# EAGLE design untitled (EAGLE 6.5.0)
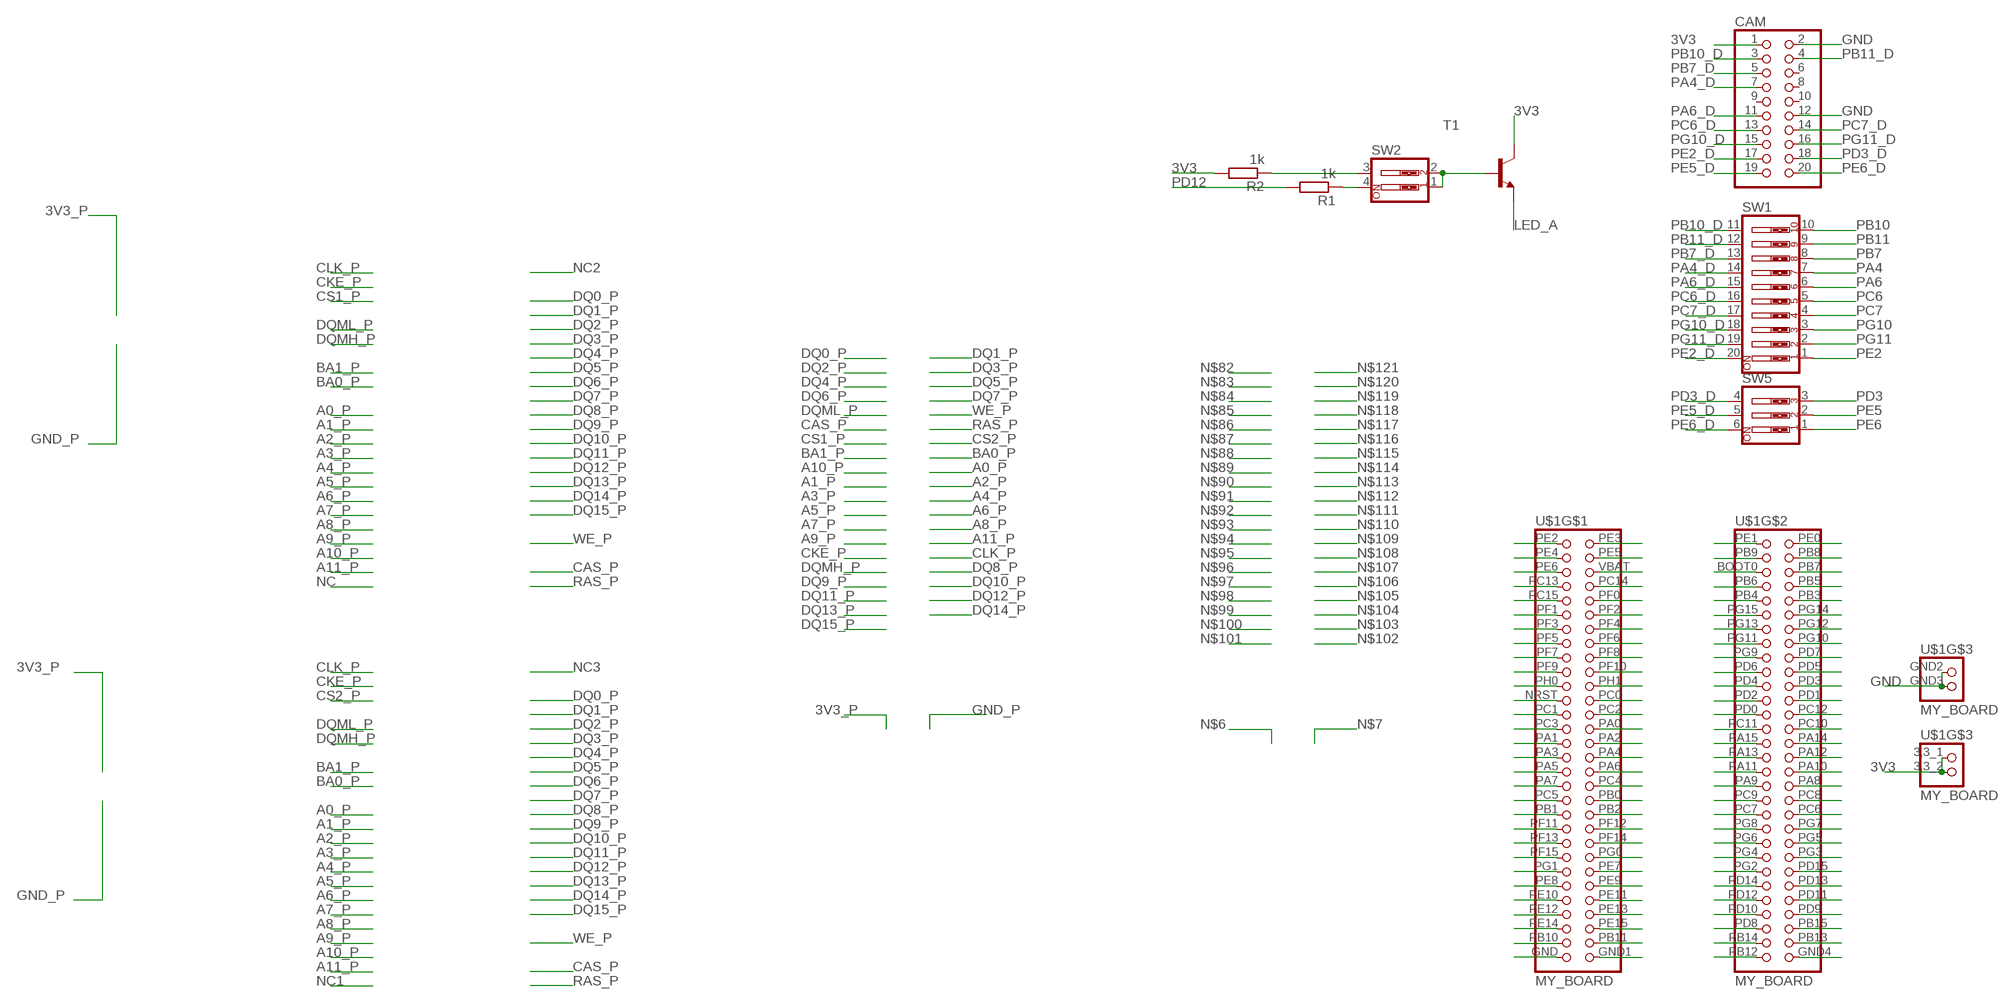
[diagram p0: schematic, sheet 1, part 1 of 2]
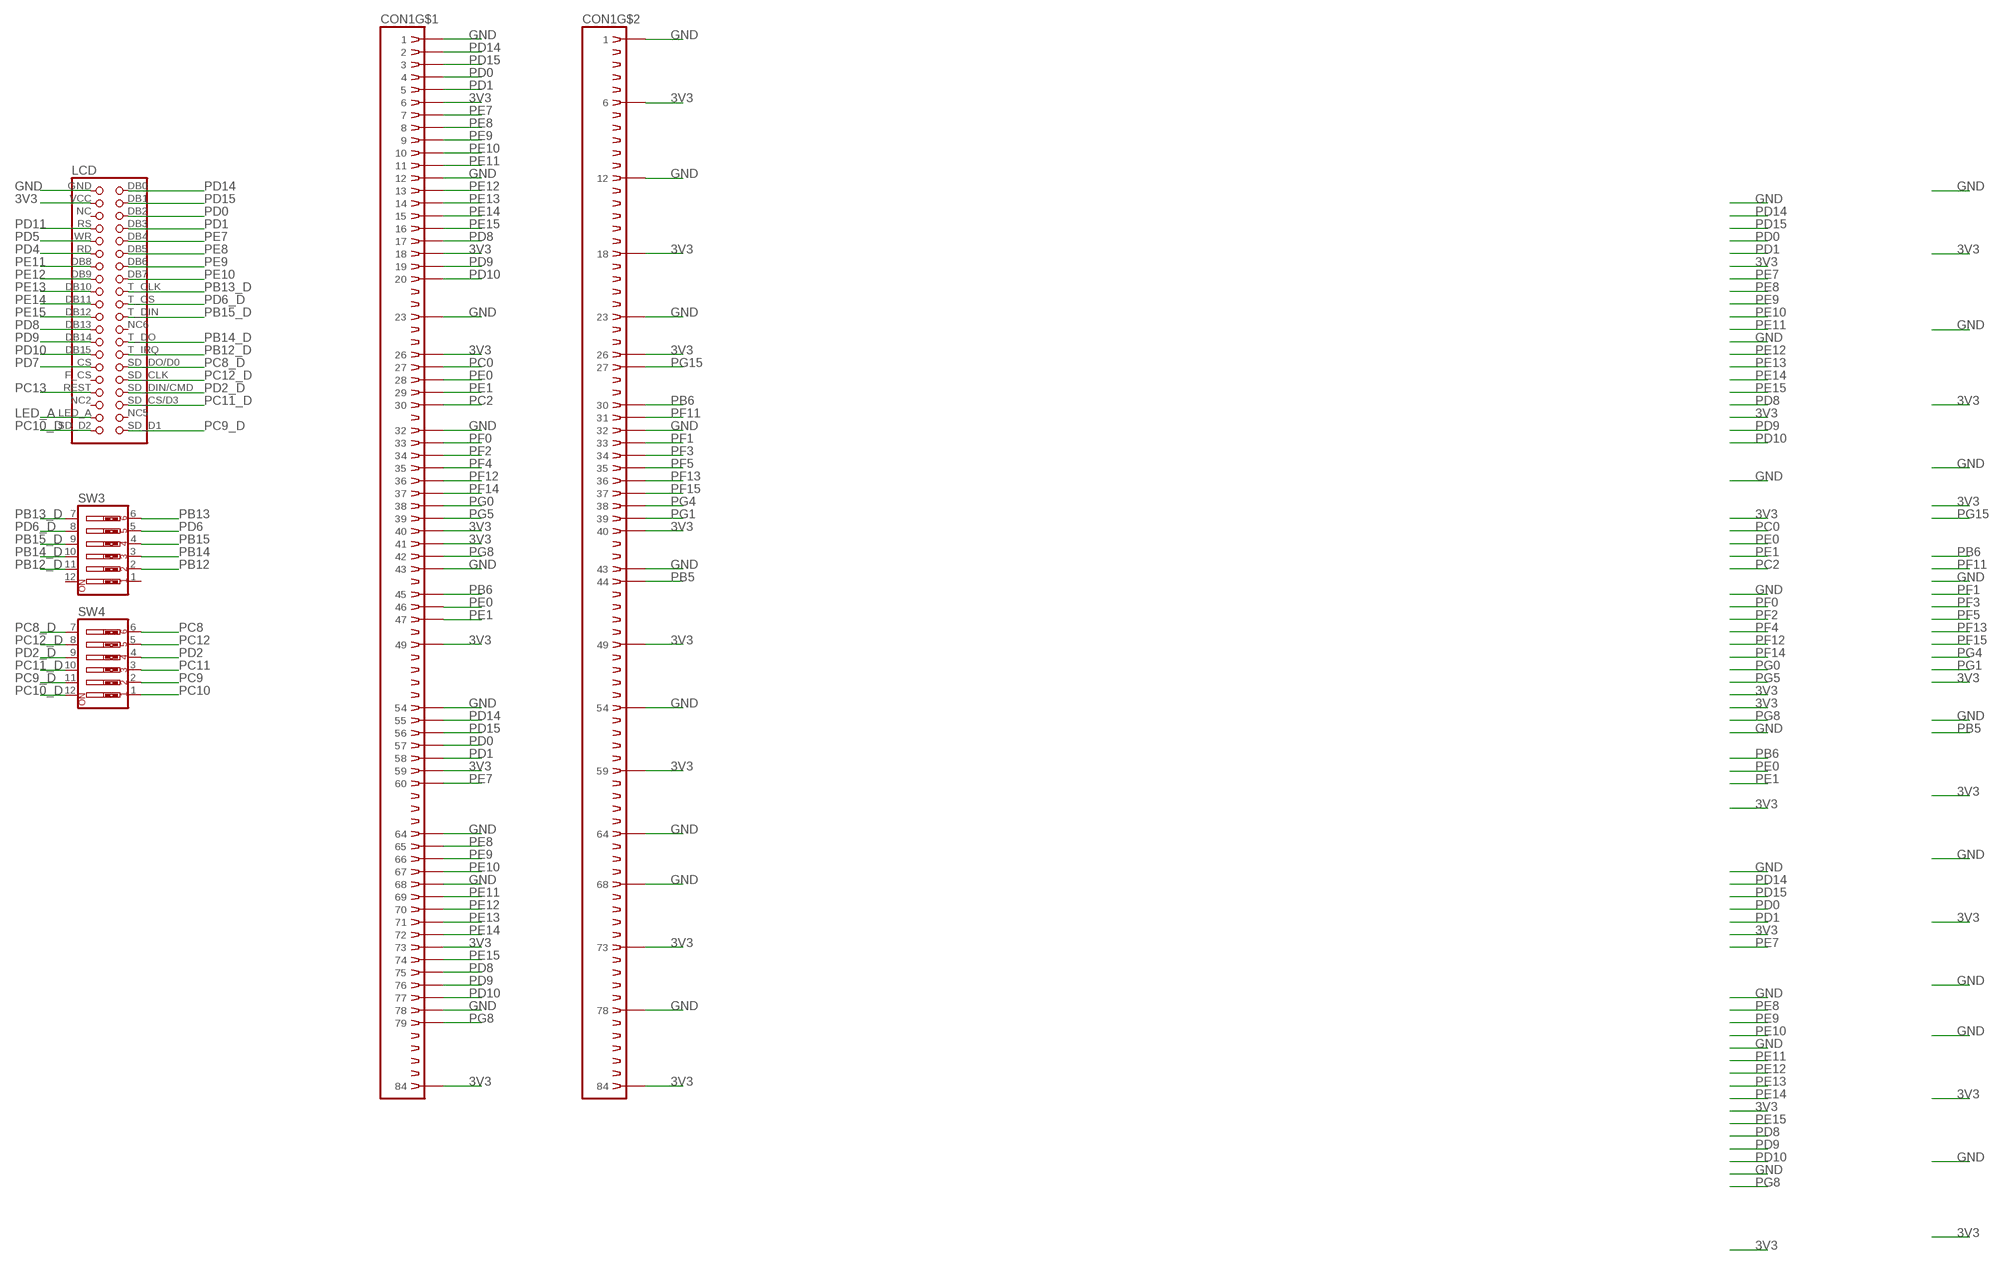
[diagram p1: schematic, sheet 1, part 2 of 2]

## Parts
CAM  PINHD-2X10  [2X10]
CON1  DIMM168  [390052-4]
LCD  LCD320QVBLCD320QVB  [2X20]
R1  1k  R-EU_0204/5  [0204/5]
R2  1k  R-EU_0204/5  [0204/5]
SW1  SW_DIP-10  [EDG-10]
SW2  SW_DIP-2  [EDG-02]
SW3  SW_DIP-6  [EDG-06]
SW4  SW_DIP-6  [EDG-06]
SW5  SW_DIP-3  [EDG-03]
T1  BC337-NPN-TO92-CBE  [TO92-CBE]
U$1  MY_BOARD  [MY_BOARD]

## Nets
3V3: CAM.1 CON1.6 CON1.18 CON1.26 CON1.40 CON1.41 CON1.49 CON1.59 CON1.73 CON1.84 CON1.90 CON1.102 CON1.110 CON1.124 CON1.133 CON1.143 CON1.157 CON1.168 LCD.VCC R2.2 T1.C U$1.3,3_1 U$1.3,3_2
BOOT0: U$1.BOOT0
GND: CAM.2 CAM.12 CON1.1 CON1.12 CON1.23 CON1.32 CON1.43 CON1.54 CON1.64 CON1.68 CON1.78 CON1.85 CON1.96 CON1.107 CON1.116 CON1.127 CON1.138 CON1.148 CON1.152 CON1.162 LCD.GND U$1.GND U$1.GND1 U$1.GND2 U$1.GND3 U$1.GND4
LED_A: LCD.LED_A T1.E
N$2: SW2.1 SW2.2 T1.B
N$3: R2.1 SW2.3
N$5: R1.1 SW2.4
NRST: U$1.NRST
PA0: U$1.PA0
PA1: U$1.PA1
PA2: U$1.PA2
PA3: U$1.PA3
PA4: SW1.7 U$1.PA4
PA4_D: CAM.7 SW1.14
PA5: U$1.PA5
PA6: SW1.6 U$1.PA6
PA6_D: CAM.11 SW1.15
PA7: U$1.PA7
PA8: U$1.PA8
PA9: U$1.PA9
PA10: U$1.PA10
PA11: U$1.PA11
PA12: U$1.PA12
PA13: U$1.PA13
PA14: U$1.PA14
PA15: U$1.PA15
PB0: U$1.PB0
PB1: U$1.PB1
PB2: U$1.PB2
PB3: U$1.PB3
PB4: U$1.PB4
PB5: CON1.128 U$1.PB5
PB6: CON1.45 CON1.114 U$1.PB6
PB7: SW1.8 U$1.PB7
PB7_D: CAM.5 SW1.13
PB8: U$1.PB8
PB9: U$1.PB9
PB10: SW1.10 U$1.PB10
PB10_D: CAM.3 SW1.11
PB11: SW1.9 U$1.PB11
PB11_D: CAM.4 SW1.12
PB12: SW3.2 U$1.PB12
PB12_D: LCD.T_IRQ SW3.11
PB13: SW3.6 U$1.PB13
PB13_D: LCD.T_CLK SW3.7
PB14: SW3.3 U$1.PB14
PB14_D: LCD.T_DO SW3.10
PB15: SW3.4 U$1.PB15
PB15_D: LCD.T_DIN SW3.9
PC0: CON1.27 U$1.PC0
PC1: U$1.PC1
PC2: CON1.30 U$1.PC2
PC3: U$1.PC3
PC4: U$1.PC4
PC5: U$1.PC5
PC6: SW1.5 U$1.PC6
PC6_D: CAM.13 SW1.16
PC7: SW1.4 U$1.PC7
PC7_D: CAM.14 SW1.17
PC8: SW4.6 U$1.PC8
PC8_D: LCD.SD_DO/D0 SW4.7
PC9: SW4.2 U$1.PC9
PC9_D: LCD.SD_D1 SW4.11
PC10: SW4.1 U$1.PC10
PC10_D: LCD.SD_D2 SW4.12
PC11: SW4.3 U$1.PC11
PC11_D: LCD.SD_CS/D3 SW4.10
PC12: SW4.5 U$1.PC12
PC12_D: LCD.SD_CLK SW4.8
PC13: LCD.REST U$1.PC13
PC14: U$1.PC14
PC15: U$1.PC15
PD0: CON1.4 CON1.57 LCD.DB2 U$1.PD0
PD1: CON1.5 CON1.58 LCD.DB3 U$1.PD1
PD2: SW4.4 U$1.PD2
PD2_D: LCD.SD_DIN/CMD SW4.9
PD3: SW5.3 U$1.PD3
PD3_D: CAM.18 SW5.4
PD4: LCD.RD U$1.PD4
PD5: LCD.WR U$1.PD5
PD6: SW3.5 U$1.PD6
PD6_D: LCD.T_CS SW3.8
PD7: LCD.CS U$1.PD7
PD8: CON1.17 CON1.75 LCD.DB13 U$1.PD8
PD9: CON1.19 CON1.76 LCD.DB14 U$1.PD9
PD10: CON1.20 CON1.77 LCD.DB15 U$1.PD10
PD11: LCD.RS U$1.PD11
PD12: R1.2 U$1.PD12
PD13: U$1.PD13
PD14: CON1.2 CON1.55 LCD.DB0 U$1.PD14
PD15: CON1.3 CON1.56 LCD.DB1 U$1.PD15
PE0: CON1.28 CON1.46 U$1.PE0
PE1: CON1.29 CON1.47 U$1.PE1
PE2: SW1.1 U$1.PE2
PE2_D: CAM.17 SW1.20
PE3: U$1.PE3
PE4: U$1.PE4
PE5: SW5.2 U$1.PE5
PE5_D: CAM.19 SW5.5
PE6: SW5.1 U$1.PE6
PE6_D: CAM.20 SW5.6
PE7: CON1.7 CON1.60 LCD.DB4 U$1.PE7
PE8: CON1.8 CON1.65 LCD.DB5 U$1.PE8
PE9: CON1.9 CON1.66 LCD.DB6 U$1.PE9
PE10: CON1.10 CON1.67 LCD.DB7 U$1.PE10
PE11: CON1.11 CON1.69 LCD.DB8 U$1.PE11
PE12: CON1.13 CON1.70 LCD.DB9 U$1.PE12
PE13: CON1.14 CON1.71 LCD.DB10 U$1.PE13
PE14: CON1.15 CON1.72 LCD.DB11 U$1.PE14
PE15: CON1.16 CON1.74 LCD.DB12 U$1.PE15
PF0: CON1.33 U$1.PF0
PF1: CON1.117 U$1.PF1
PF2: CON1.34 U$1.PF2
PF3: CON1.118 U$1.PF3
PF4: CON1.35 U$1.PF4
PF5: CON1.119 U$1.PF5
PF6: U$1.PF6
PF7: U$1.PF7
PF8: U$1.PF8
PF9: U$1.PF9
PF10: U$1.PF10
PF11: CON1.115 U$1.PF11
PF12: CON1.36 U$1.PF12
PF13: CON1.120 U$1.PF13
PF14: CON1.37 U$1.PF14
PF15: CON1.121 U$1.PF15
PG0: CON1.38 U$1.PG0
PG1: CON1.123 U$1.PG1
PG2: U$1.PG2
PG3: U$1.PG3
PG4: CON1.122 U$1.PG4
PG5: CON1.39 U$1.PG5
PG6: U$1.PG6
PG7: U$1.PG7
PG8: CON1.42 CON1.79 U$1.PG8
PG9: U$1.PG9
PG10: SW1.3 U$1.PG10
PG10_D: CAM.15 SW1.18
PG11: SW1.2 U$1.PG11
PG11_D: CAM.16 SW1.19
PG12: U$1.PG12
PG13: U$1.PG13
PG14: U$1.PG14
PG15: CON1.111 U$1.PG15
PH0: U$1.PH0
PH1: U$1.PH1
VBAT: U$1.VBAT
Unconnected: CAM.6 CAM.8 CAM.9 CAM.10 LCD.F_CS LCD.NC LCD.NC2 LCD.NC5 LCD.NC6 SW3.1 SW3.12

## Library data of the parts
CAM = pinhead:PINHD-2X10: PIN HEADER
CON1 = Stworzone:DIMM168: AMP connector
LCD = Stworzone:LCD320QVB: LCD320 QVB
R1 R2 = rcl:R-EU_: RESISTOR, European symbol
SW1 = special:SW_DIP-10: DIP SWITCH
SW2 = special:SW_DIP-2: DIP SWITCH
SW3 SW4 = special:SW_DIP-6: DIP SWITCH
SW5 = special:SW_DIP-3: DIP SWITCH
T1 = transistor:*-NPN-: NPN Transistror BF959 corrected 2008.03.06
U$1 = Stworzone:MY_BOARD

## Board
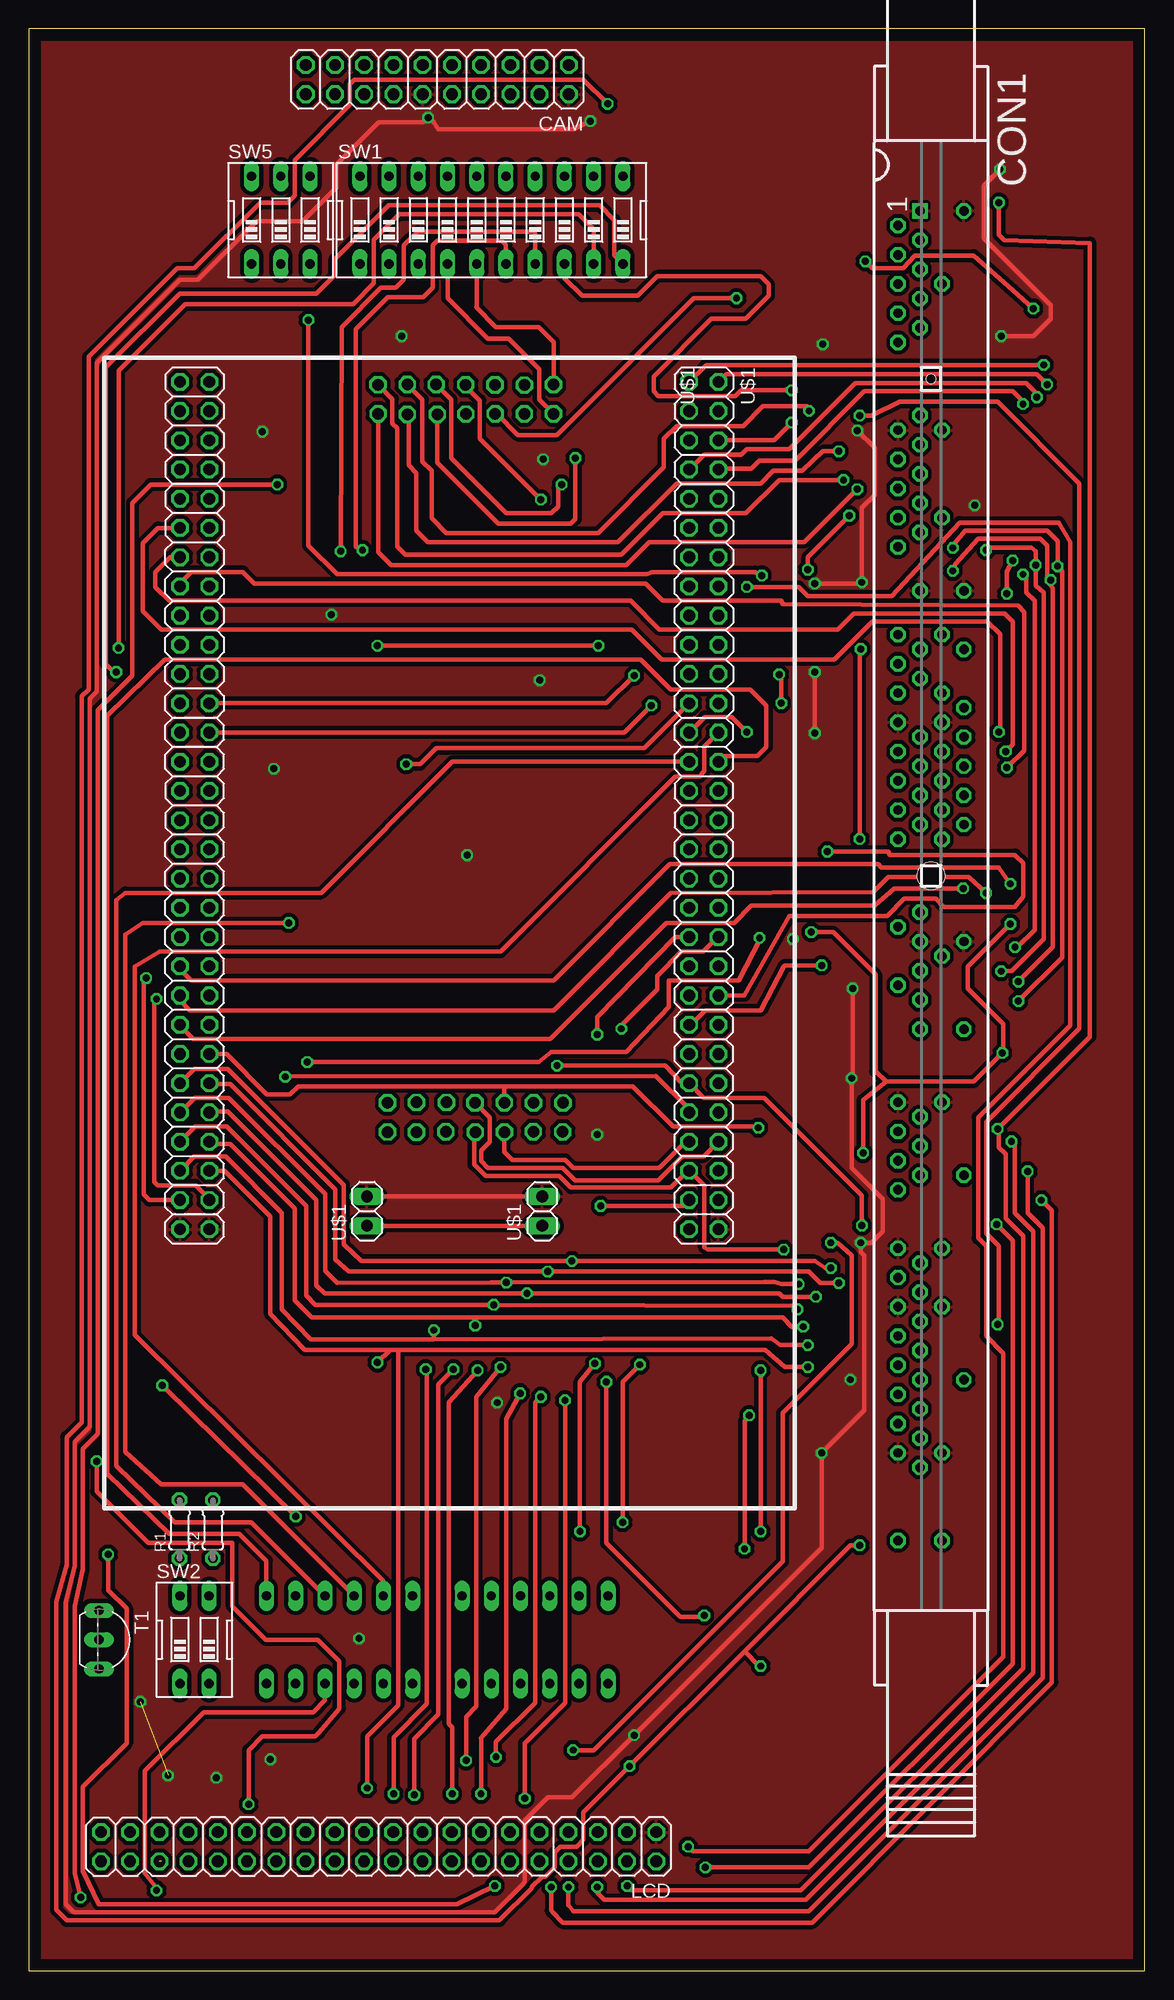
[diagram p2: board, top side]
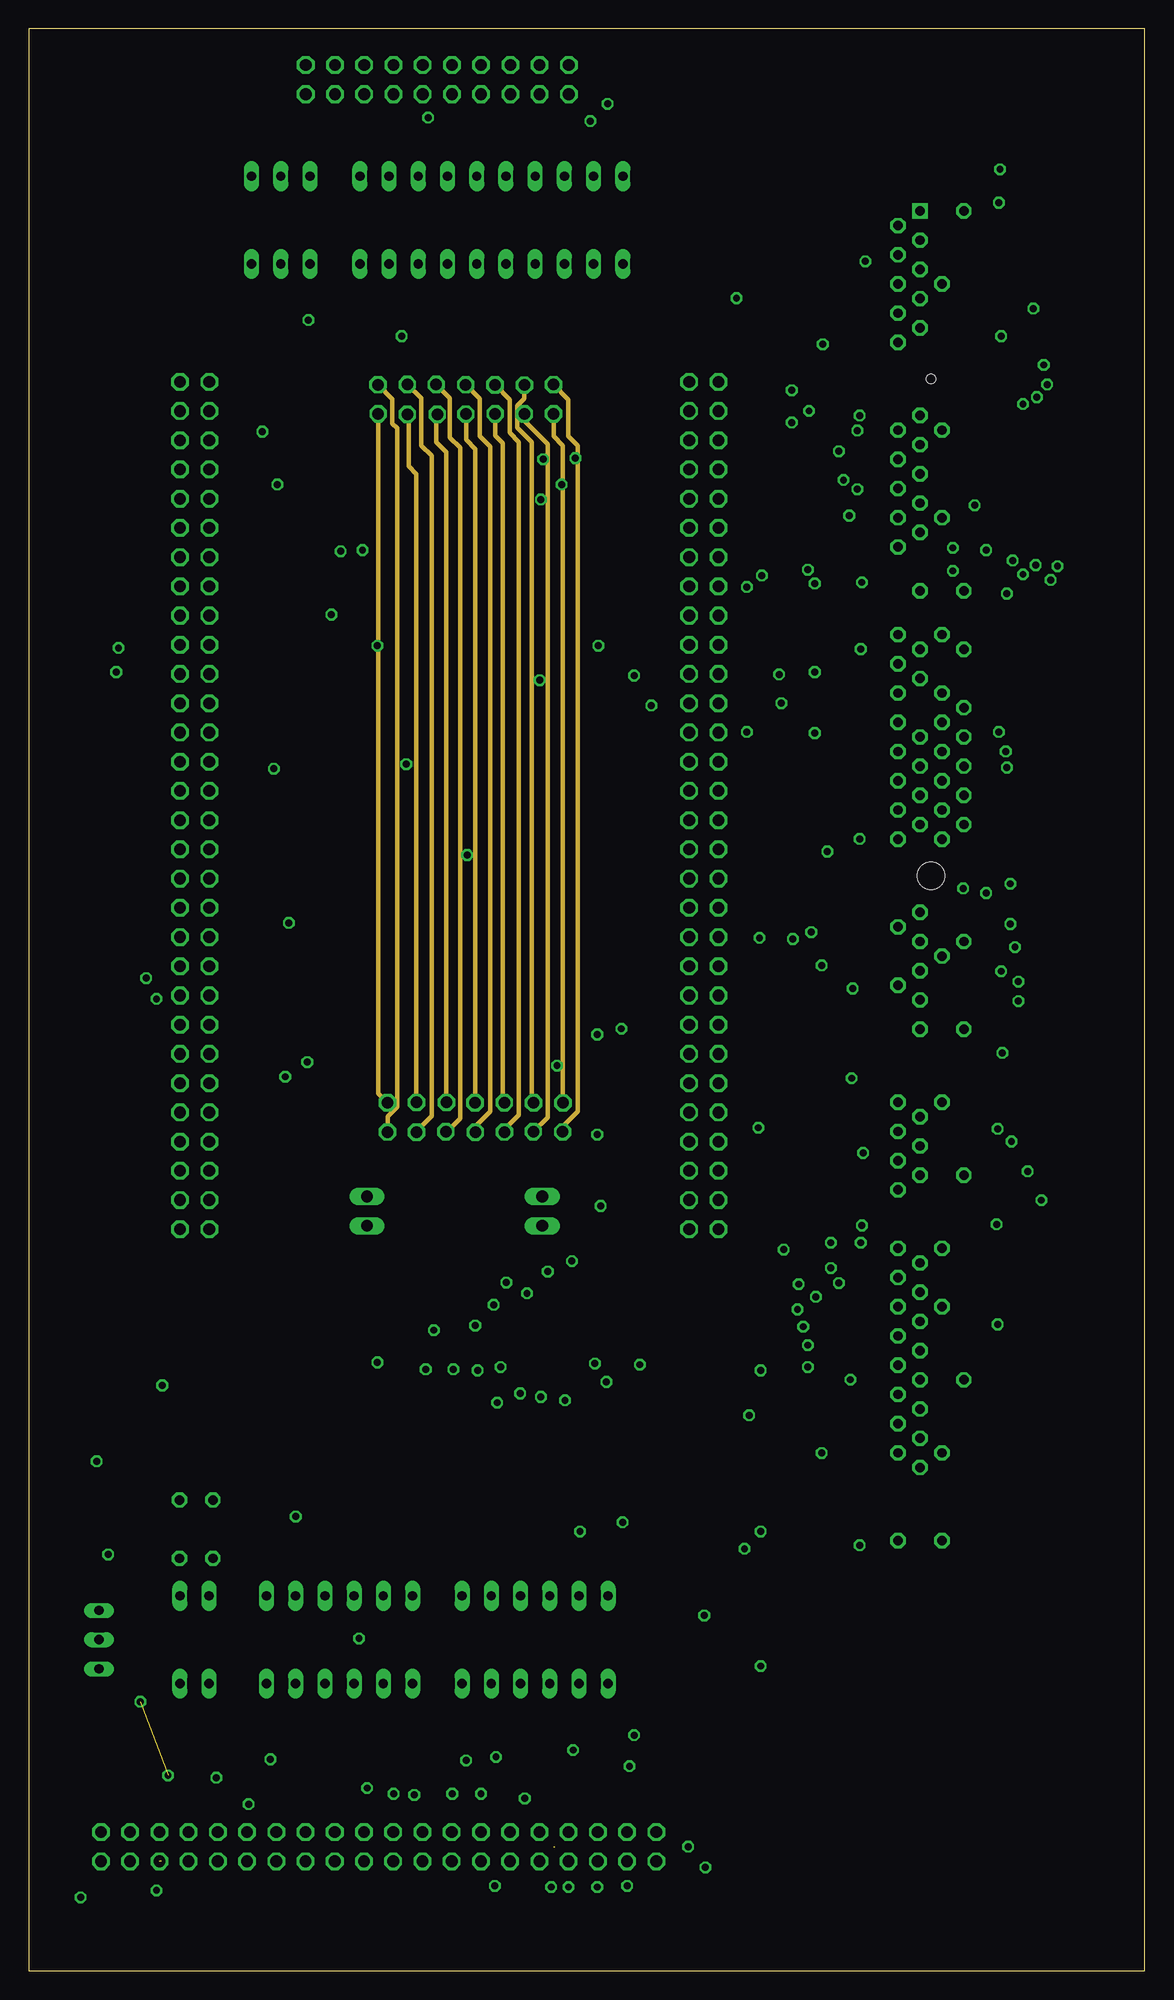
[diagram p3: board, inner layer Route8]
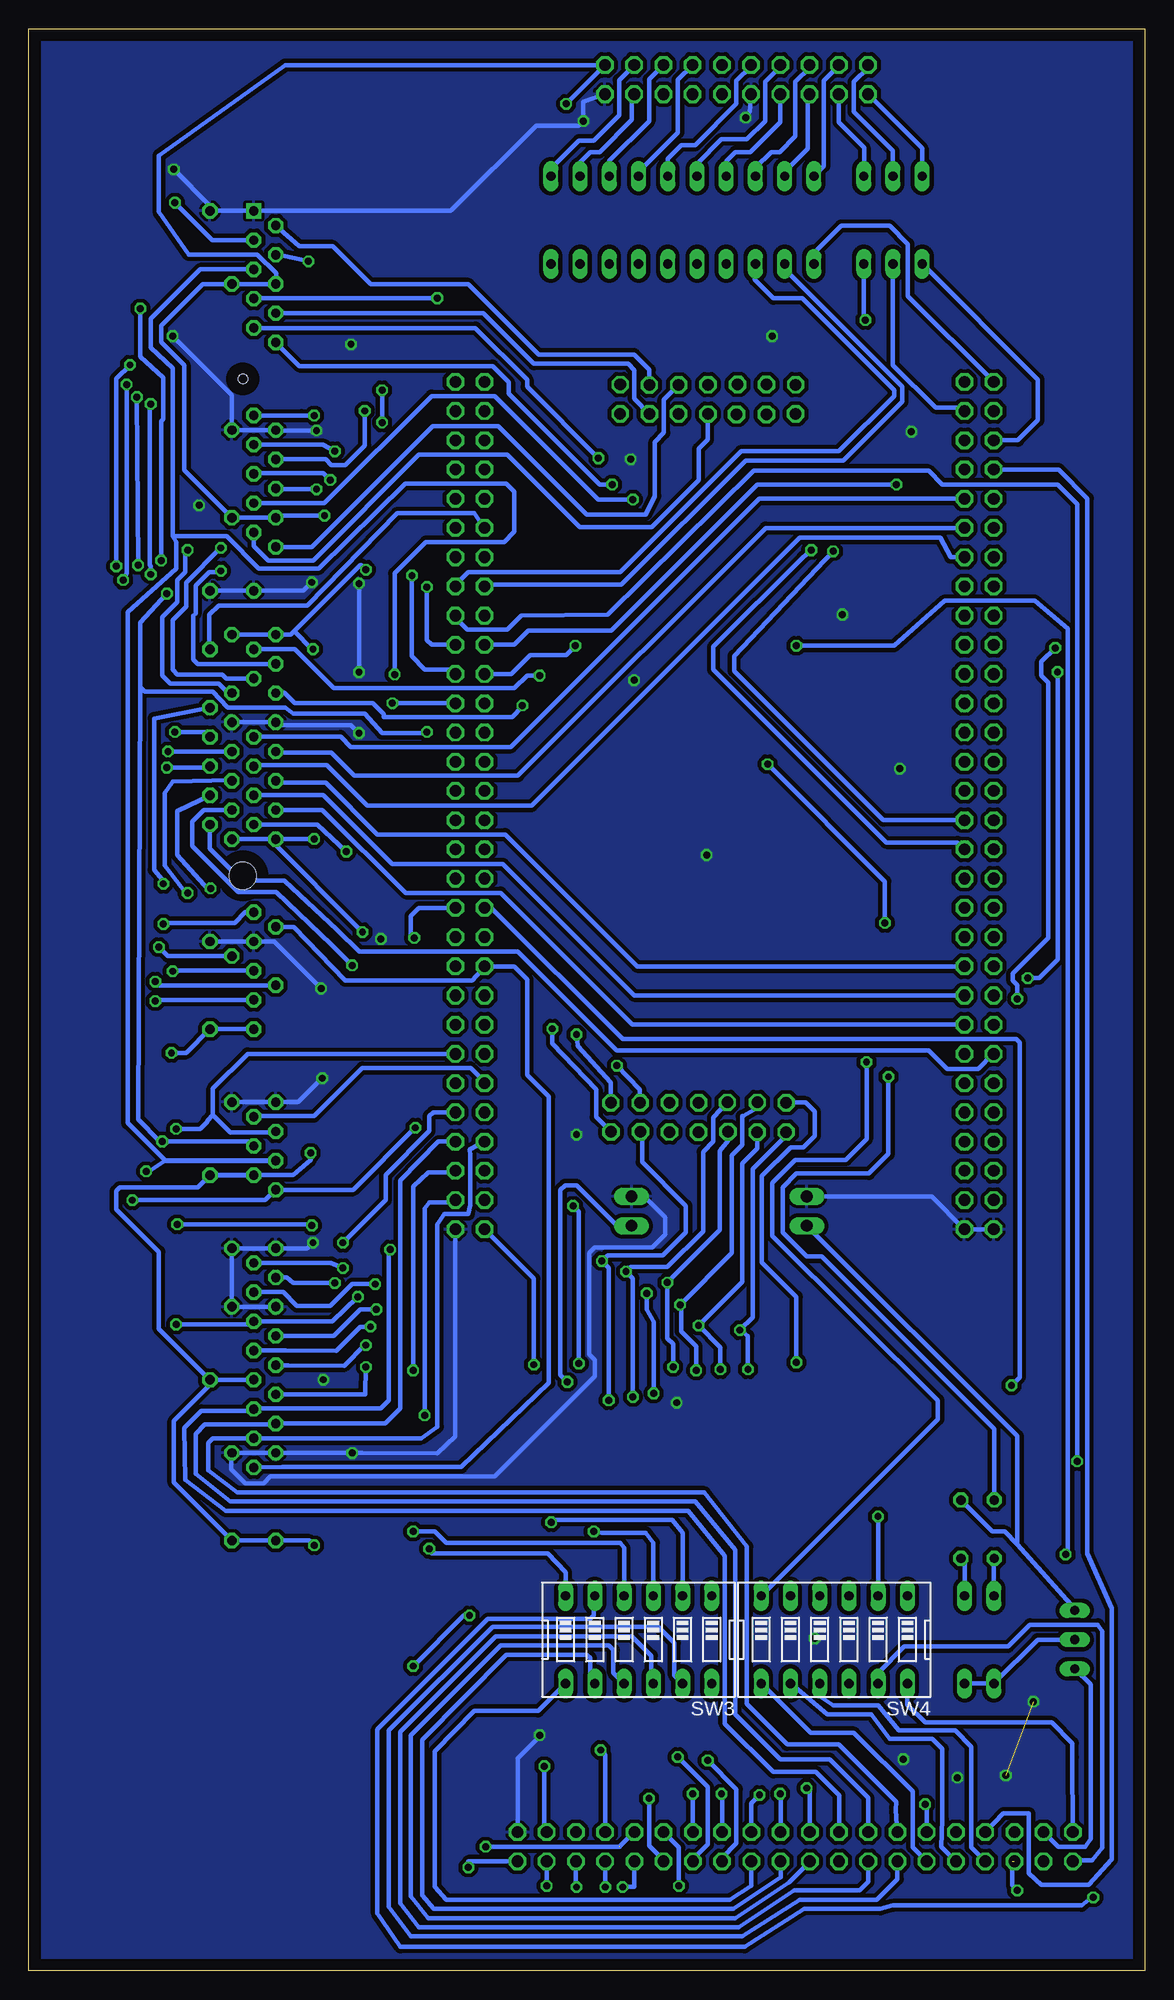
[diagram p4: board, bottom side, seen from below]

Size 97 x 168.8 mm. Coordinates in mm from the lower left corner, seen from the top.
Outline: 0,0 97,0 97,168.8 0,168.8 0,0
Copper layers (1*16): Top 0.035mm / dielectric 1.5mm / Bottom 0.035mm
Design rules "elecrow": minimum track width 10mil, minimum drill 12mil, track to track 8mil, track to pad 8mil, pad to pad 8mil, via to via 8mil, smd to smd 8mil, copper to edge 40mil, drill to drill 8mil, minimum pad ring 10mil, minimum via ring 8mil, stop-mask expansion 4mil, vias tented up to drill 0mil, thermal gap 10mil

### Footprints (pad centres in the part's own frame; a part is rotated, then mirrored left to right if it is on the bottom)
2X10 = drill 1.016 octagon: 1 -11.43,-1.27; 2 -11.43,1.27; 3 -8.89,-1.27; 4 -8.89,1.27; 5 -6.35,-1.27; 6 -6.35,1.27; 7 -3.81,-1.27; 8 -3.81,1.27; 9 -1.27,-1.27; 10 -1.27,1.27; 11 1.27,-1.27; 12 1.27,1.27; 13 3.81,-1.27; 14 3.81,1.27; 15 6.35,-1.27; 16 6.35,1.27; 17 8.89,-1.27; 18 8.89,1.27; 19 11.43,-1.27; 20 11.43,1.27
390052-4 = drill 0.813 square: 1 -57.785,-0.953 | drill 0.813 octagon: 2 -56.515,-2.857; 3 -55.245,-0.953; 4 -53.975,-2.857; 5 -52.705,-0.953; 6 -51.435,-2.857; 7 -50.165,-0.953; 8 -48.895,-2.857; 9 -47.625,-0.953; 10 -46.355,-2.857; 11 -40.005,-0.953; 12 -38.735,-2.857; 13 -37.465,-0.953; 14 -36.195,-2.857; 15 -34.925,-0.953; 16 -33.655,-2.857; 17 -32.385,-0.953; 18 -31.115,-2.857; 19 -29.845,-0.953; 20 -28.575,-2.857; 23 -24.765,-0.953; 26 -20.955,-2.857; 27 -19.685,-0.953; 28 -18.415,-2.857; 29 -17.145,-0.953; 30 -15.875,-2.857; 32 -13.335,-2.857; 33 -12.065,-0.953; 34 -10.795,-2.857; 35 -9.525,-0.953; 36 -8.255,-2.857; 37 -6.985,-0.953; 38 -5.715,-2.857; 39 -4.445,-0.953; 40 -3.175,-2.857; 41 3.175,-0.953; 42 4.445,-2.857; 43 5.715,-0.953; 45 8.255,-0.953; 46 9.525,-2.857; 47 10.795,-0.953; 49 13.335,-0.953; 54 19.685,-2.857; 55 20.955,-0.953; 56 22.225,-2.857; 57 23.495,-0.953; 58 24.765,-2.857; 59 26.035,-0.953; 60 27.305,-2.857; 64 32.385,-2.857; 65 33.655,-0.953; 66 34.925,-2.857; 67 36.195,-0.953; 68 37.465,-2.857; 69 38.735,-0.953; 70 40.005,-2.857; 71 41.275,-0.953; 72 42.545,-2.857; 73 43.815,-0.953; 74 45.085,-2.857; 75 46.355,-0.953; 76 47.625,-2.857; 77 48.895,-0.953; 78 50.165,-2.857; 79 51.435,-0.953; 84 57.785,-2.857; 85 -57.785,2.857; 90 -51.435,0.953; 96 -38.735,0.953; 102 -31.115,0.953; 107 -24.765,2.857; 110 -20.955,0.953; 111 -19.685,2.857; 114 -15.875,0.953; 115 -14.605,2.857; 116 -13.335,0.953; 117 -12.065,2.857; 118 -10.795,0.953; 119 -9.525,2.857; 120 -8.255,0.953; 121 -6.985,2.857; 122 -5.715,0.953; 123 -4.445,2.857; 124 -3.175,0.953; 127 5.715,2.857; 128 6.985,0.953; 133 13.335,2.857; 138 19.685,0.953; 143 26.035,2.857; 148 32.385,0.953; 152 37.465,0.953; 157 43.815,2.857; 162 50.165,0.953; 168 57.785,0.953 | hole 2.362: 0,0 | hole 0.813: -43.18,0
2X20 = drill 1.016 octagon: CS 11.43,-1.27; DB0 -24.13,1.27; DB1 -21.59,1.27; DB2 -19.05,1.27; DB3 -16.51,1.27; DB4 -13.97,1.27; DB5 -11.43,1.27; DB6 -8.89,1.27; DB7 -6.35,1.27; DB8 -8.89,-1.27; DB9 -6.35,-1.27; DB10 -3.81,-1.27; DB11 -1.27,-1.27; DB12 1.27,-1.27; DB13 3.81,-1.27; DB14 6.35,-1.27; DB15 8.89,-1.27; F_CS 13.97,-1.27; GND -24.13,-1.27; LED_A 21.59,-1.27; NC -19.05,-1.27; NC2 19.05,-1.27; NC5 21.59,1.27; NC6 3.81,1.27; RD -11.43,-1.27; REST 16.51,-1.27; RS -16.51,-1.27; SD_CLK 13.97,1.27; SD_CS/D3 19.05,1.27; SD_D1 24.13,1.27; SD_D2 24.13,-1.27; SD_DIN/CMD 16.51,1.27; SD_DO/D0 11.43,1.27; T_CLK -3.81,1.27; T_CS -1.27,1.27; T_DIN 1.27,1.27; T_DO 6.35,1.27; T_IRQ 8.89,1.27; VCC -21.59,-1.27; WR -13.97,-1.27
0204/5 = drill 0.813 octagon: 1 -2.54,0; 2 2.54,0
EDG-10 = drill 0.813 long: 1 -11.43,-3.81; 2 -8.89,-3.81; 3 -6.35,-3.81; 4 -3.81,-3.81; 5 -1.27,-3.81; 6 1.27,-3.81; 7 3.81,-3.81; 8 6.35,-3.81; 9 8.89,-3.81; 10 11.43,-3.81; 11 11.43,3.81; 12 8.89,3.81; 13 6.35,3.81; 14 3.81,3.81; 15 1.27,3.81; 16 -1.27,3.81; 17 -3.81,3.81; 18 -6.35,3.81; 19 -8.89,3.81; 20 -11.43,3.81
EDG-02 = drill 0.813 long: 1 -1.27,-3.81; 2 1.27,-3.81; 3 1.27,3.81; 4 -1.27,3.81
EDG-06 = drill 0.813 long: 1 -6.35,-3.81; 2 -3.81,-3.81; 3 -1.27,-3.81; 4 1.27,-3.81; 5 3.81,-3.81; 6 6.35,-3.81; 7 6.35,3.81; 8 3.81,3.81; 9 1.27,3.81; 10 -1.27,3.81; 11 -3.81,3.81; 12 -6.35,3.81
EDG-03 = drill 0.813 long: 1 -2.54,-3.81; 2 0,-3.81; 3 2.54,-3.81; 4 2.54,3.81; 5 0,3.81; 6 -2.54,3.81
TO92-CBE = drill 0.813 long: B 0,0; C -2.54,0; E 2.54,0
MY_BOARD = drill 1.016 long: 3,3_1 12.34,-5.43; 3,3_2 27.57,-5.43; GND2 12.34,-2.89; GND3 27.57,-2.89 | drill 1.016 octagon: BOOT0 40.34,62.84; GND -3.9,-5.74; GND1 -1.36,-5.74; GND4 42.88,-5.74; NRST -3.9,39.98; PA0 -1.36,34.9; PA1 -3.9,32.36; PA2 -1.36,32.36; PA3 -3.9,29.82; PA4 -1.36,29.82; PA5 -3.9,27.28; PA6 -1.36,27.28; PA7 -3.9,24.74; PA8 42.88,24.74; PA9 40.34,24.74; PA10 42.88,27.28; PA11 40.34,27.28; PA12 42.88,29.82; PA13 40.34,29.82; PA14 42.88,32.36; PA15 40.34,32.36; PB0 -1.36,22.2; PB1 -3.9,19.66; PB2 -1.36,19.66; PB3 42.88,57.76; PB4 40.34,57.76; PB5 42.88,60.3; PB6 40.34,60.3; PB7 42.88,62.84; PB8 42.88,65.38; PB9 40.34,65.38; PB10 -3.9,-3.2; PB11 -1.36,-3.2; PB12 40.34,-5.74; PB13 42.88,-3.2; PB14 40.34,-3.2; PB15 42.88,-0.66; PC0 -1.36,39.98; PC1 -3.9,37.44; PC2 -1.36,37.44; PC3 -3.9,34.9; PC4 -1.36,24.74; PC5 -3.9,22.2; PC6 42.88,19.66; PC7 40.34,19.66; PC8 42.88,22.2; PC9 40.34,22.2; PC10 42.88,34.9; PC11 40.34,34.9; PC12 42.88,37.44; PC13 -3.9,60.3; PC14 -1.36,60.3; PC15 -3.9,57.76; PD0 40.34,37.44; PD1 42.88,39.98; PD2 40.34,39.98; PD3 42.88,42.52; PD4 40.34,42.52; PD5 42.88,45.06; PD6 40.34,45.06; PD7 42.88,47.6; PD8 40.34,-0.66; PD9 42.88,1.88; PD10 40.34,1.88; PD11 42.88,4.42; PD12 40.34,4.42; PD13 42.88,6.96; PD14 40.34,6.96; PD15 42.88,9.5; PE0 42.88,67.92; PE1 40.34,67.92; PE2 -3.9,67.92; PE3 -1.36,67.92; PE4 -3.9,65.38; PE5 -1.36,65.38; PE6 -3.9,62.84; PE7 -1.36,9.5; PE8 -3.9,6.96; PE9 -1.36,6.96; PE10 -3.9,4.42; PE11 -1.36,4.42; PE12 -3.9,1.88; PE13 -1.36,1.88; PE14 -3.9,-0.66; PE15 -1.36,-0.66; PF0 -1.36,57.76; PF1 -3.9,55.22; PF2 -1.36,55.22; PF3 -3.9,52.68; PF4 -1.36,52.68; PF5 -3.9,50.14; PF6 -1.36,50.14; PF7 -3.9,47.6; PF8 -1.36,47.6; PF9 -3.9,45.06; PF10 -1.36,45.06; PF11 -3.9,17.12; PF12 -1.36,17.12; PF13 -3.9,14.58; PF14 -1.36,14.58; PF15 -3.9,12.04; PG0 -1.36,12.04; PG1 -3.9,9.5; PG2 40.34,9.5; PG3 42.88,12.04; PG4 40.34,12.04; PG5 42.88,14.58; PG6 40.34,14.58; PG7 42.88,17.12; PG8 40.34,17.12; PG9 40.34,47.6; PG10 42.88,50.14; PG11 40.34,50.14; PG12 42.88,52.68; PG13 40.34,52.68; PG14 42.88,55.22; PG15 40.34,55.22; PH0 -3.9,42.52; PH1 -1.36,42.52; VBAT -1.36,62.84

### Placement (x,y rotation side)
CAM  35.5,164.38 180 top
CON1  78.4,95.18 270 top
LCD  30.4,10.78 180 top
R1  13.1,38.38 90 top
R2  16,38.38 90 top
SW1  40.2,152.18 0 top
SW2  14.4,28.78 0 top
SW3  44,28.78 180 bottom
SW4  27,28.78 180 bottom
SW5  21.9,152.18 0 top
T1  6.1,28.78 270 top
U$1  17.05,70.19 0 top

### Tracks (layer width: path | path; a pad name or v marks a point on that pad's centre or on a via)
3V3  (via drill 0.6)
  Top 0.406: U$1.3,3_2 U$1.3,3_1 | 62.2,27.78 v52.2,17.78 48.2,13.78 48.2,11.38 47.6,10.78 46.2,10.78 45.7,10.28 45.7,8.98 44.9,8.18 44.6,8.18 43.7,7.28 43.7,7.18 40.9,4.38 3.3,4.38 2.4,5.28 2.4,32.08 3.3,35.28 3.3,46.38 4.6,47.68 4.6,110.78 5.2,111.38 5.2,111.78 | 62.2,27.78 71.4,36.98 v72.2,36.98 | v50.2,51.18 50.2,37.18 56.6,30.78 58.6,30.78 v58.7,30.88 | v63.6,26.48 63.5,26.48 62.2,27.78 | v72.5,71.08 72.5,75.68 74.5,77.28 | 74.5,77.28 82.1,77.28 v84.6,79.78 84.7,79.88 84.7,82.28 81.6,85.38 81.6,87.28 v85.3,90.98 | v68,90.28 69.9,90.28 73.6,86.58 73.6,78.18 74.5,77.28 | v67.7,121.78 67.7,122.88 v71.3,126.48 | v72.2,98.38 72.2,114.78 v72.3,114.88 | 5.2,111.88 5.2,140.28 12.9,147.98 14.4,147.98 20.1,153.68 22.5,153.68 23.1,154.28 23.1,157.38 27.9,162.18 27.9,163.98 28.3,164.38 48.2,164.38 v50.3,162.28
  Bottom 0.406: CON1.73 CON1.157 | CON1.59 CON1.143 | CON1.49 CON1.133 83.32,79.78 v84.6,79.78 | CON1.110 CON1.26 74.25,116.13 73.95,116.43 | T1.C 6.04,31.42 11.1,37.08 | 11.1,37.08 12.2,38.18 13.26,38.18 R2.2 | U$1.3,3_1 11.1,46.47 11.1,37.08 | CON1.6 CON1.90 | LCD.VCC 52.2,12.26 v52.2,17.78 | v72.2,36.98 72.62,37.39 CON1.84 CON1.168 84.4,42.44 84.4,47.78 81.26,50.92 CON1.157 | U$1.3,3_2 45.88,64.76 49.4,68.28 50.4,68.28 50.8,67.88 50.8,51.78 v50.2,51.18 | v58.7,30.88 59.2,30.88 v63.6,26.48 | CON1.157 85.7,55.81 85.7,62.48 89.4,66.18 89.4,67.78 89.1,68.08 82.32,68.08 CON1.143 | CON1.143 81.22,69.18 74,69.18 72.5,70.48 v72.5,71.08 | CON1.90 75.56,146.62 75.5,146.68 75.5,147.55 77.13,149.18 83.1,149.18 85.7,152.88 85.7,157.78 74.73,165.65 CAM.1 v50.3,162.28 | CON1.41 78.18,92 79.1,91.08 85.2,91.08 v85.3,90.98 | v68,90.28 76.07,98.35 CON1.124 CON1.40 72.22,98.35 v72.2,98.38 | CON1.90 81.87,146.62 85.5,142.98 85.5,141.58 83.5,139.58 83.5,130.44 CON1.102 CON1.18 75.36,126.48 v71.3,126.48 | 73.95,116.43 68.2,122.18 68.1,122.18 v67.7,121.78 | v72.3,114.88 72.4,114.88 73.95,116.43
GND  (via drill 0.6)  (1 unrouted)
  Top 0.406: v48.8,160.78 47.3,160.08 35.6,160.08 35.2,160.68 v34.7,161.08 34.3,160.68 30.4,160.68 26.7,156.98 26.7,154.98 23.8,152.08 19.8,152.08 14.7,146.98 13.1,146.98 5.9,139.78 5.9,111.18 5.3,110.58 5.3,47.28 4,45.98 4,35.18 3.2,32.08 3.2,5.78 3.9,5.08 40.5,5.08 43.1,7.68 43.1,13.08 45.1,15.08 47.2,15.08 v52.6,20.48 68.9,36.78 v68.9,45 72.6,48.7 72.6,62.18 72.3,62.48 v72.3,63.28 73.2,63.28 74.2,64.28 74.2,67.08 71.5,69.78 v71.5,77.58 71.6,77.68 v71.6,85.38 | U$1.GND2 U$1.GND3 | v84.4,156.58 83,155.18 83,150.58 88.8,144.78 88.8,143.58 87.3,142.08 v84.5,142.08 | v72,133.88 73.5,132.38 73.5,128.28 72.4,127.18 v72.4,120.68 72,120.58 v68.3,120.58 | v68.3,107.58 v68.3,112.88
  Bottom 0.406: CAM.12 34.33,161.61 v34.7,161.08 | CAM.2 48.8,162.44 v48.8,160.78 49.2,160.38 52.9,160.38 60.32,152.97 CON1.1 CON1.85 81.26,153.44 v84.4,156.58 | v68.9,45 74.06,45.02 CON1.78 CON1.162 79.4,44.97 79.4,43.58 78.2,42.38 76.6,42.38 76,42.98 56.5,42.98 47.8,51.68 47.8,53.08 48.3,53.58 48.3,62.38 47.8,62.88 42.8,62.88 41.7,63.98 41.7,65.48 43.52,67.3 U$1.GND3 | v68.9,45 61.5,44.98 59.93,46.43 U$1.GND4 | CON1.68 CON1.152 CON1.148 | CON1.64 CON1.148 | U$1.GND U$1.GND1 18.54,67.3 U$1.GND2 | CON1.138 CON1.54 73.59,75.5 v71.5,77.58 | CON1.43 CON1.127 75.69,89.47 v71.6,85.38 | CON1.116 CON1.32 75.31,108.28 69,108.28 v68.3,107.58 | CON1.107 CON1.23 73.13,119.94 v72.4,120.68 | LCD.GND 54.5,12.08 54.5,18.48 52.6,20.38 v52.6,20.48 | v68.9,45 68,45 | CON1.148 72.78,62.8 v72.3,63.28 | v84.5,142.08 79.35,136.93 CON1.96 CON1.12 75.51,133.88 v72,133.88 | v68.3,112.88 v68.3,120.58
  other vias: 38.1,96.98 20.3,133.78 32.4,142.08 21.3,104.48 40.7,49.38 49.4,72.68 26.3,117.88 28.7,28.88 12.1,16.98 9.7,23.38 44.7,131.38 69,141.38 82.2,127.38 66.4,89.68 71.4,51.38 21,18.38 16.3,16.78 44.4,112.18
  pour Bottom (isolate 0.355): 0.8,168.08 96.2,168.08 96.2,0.78 0.8,0.78
  pour Top (isolate 0.355): 0.8,168.08 96.2,168.08 96.2,0.78 0.8,0.78
LED_A
  Bottom 0.406: LCD.LED_A 7.54,10.78 5.2,10.78 4.7,11.48 4.7,24.88 T1.E
N$2
  Bottom 0.406: T1.B 9.32,28.78 SW2.1 SW2.2
N$3
  Bottom 0.406: SW2.3 15.67,35.51 R2.1
N$5
  Bottom 0.406: SW2.4 13.13,35.81 R1.1
PA4  (via drill 0.6)
  Top 0.406: SW1.7 44.01,150.97 43.8,151.18 33.8,151.18 32.6,149.98 32.6,146.98 31.9,146.28 30.6,146.28 27.2,142.88 v27.1,123.38
  Bottom 0.406: U$1.PA4 22.73,100.01 35.7,112.98 35.7,114.28 v27.1,123.38
PA4_D
  Bottom 0.406: CAM.7 40.6,164.36 40.6,159.78 44.01,156.37 SW1.14
PA6  (via drill 0.6)
  Top 0.406: v29,123.48 28.4,123.78 28.4,142.68 31.2,145.48 34.3,145.48 35.1,146.28 35.1,149.98 35.5,150.38 41.1,150.38 41.47,150.01 SW1.6
  Bottom 0.406: v29,123.48 29.8,122.78 37.5,115.08 37.5,113.08 22.5,98.08 16.3,98.08 U$1.PA6
PA6_D
  Bottom 0.406: CAM.11 34.23,165.55 35.5,164.28 35.5,162.28 39.1,158.68 40.3,158.68 41.47,157.51 SW1.15
PB5  (via drill 0.6)
  Top 0.406: v85.7,88.98 85.9,88.98 87.4,90.48 87.4,119.08 86.7,119.78 86.7,121.08 v86.4,121.38 | v86.4,136.18 86.4,136.38 85.5,137.28 72.6,137.28 66.6,131.28 63.5,131.28 62.8,130.58 60.02,130.58 U$1.PB5
  Bottom 0.406: CON1.128 84.91,88.19 v85.7,88.98 | v86.4,121.38 86.4,122.08 86.5,122.18 86.5,136.08 v86.4,136.18
PB6  (via drill 0.6)
  Top 0.406: v84.5,86.88 85.4,86.88 88.2,89.68 88.2,119.78 87.5,120.38 v87.5,122.18 87.5,123.38 87.1,123.68 83.5,123.68 83.2,123.58 v83.2,123.48 | v87.6,136.78 87.6,137.08 86.7,137.98 71.8,137.98 66.1,132.28 62.4,132.28 61.9,131.78 58.68,131.78 U$1.PB6
  Bottom 0.406: CON1.45 84.5,86.92 v84.5,86.88 | v87.5,122.18 v87.6,136.78 | CON1.114 79.68,111.06 80.5,111.88 84.7,111.88 85.4,112.58 85.4,117.68 84.1,118.98 84.1,120.88 83.4,121.58 83.4,123.28 v83.2,123.48
PB7  (via drill 0.6)
  Top 0.406: U$1.PB7 59.93,133.05 64.77,133.05 v66.3,134.58 | SW1.8 46.55,147.13 48.1,145.58 52.9,145.58 54.6,147.28 63.6,147.28 64.3,146.58 64.3,145.58 62.3,143.58 59.3,143.58 54.3,138.58 54.3,137.28 54.7,136.88 61.4,136.88 61.9,137.38 v66.3,137.38
  Bottom 0.406: v66.3,134.58 v66.3,137.38
PB7_D
  Bottom 0.406: CAM.5 43.1,164.4 43.1,160.78 46.55,157.33 SW1.13
PB10  (via drill 0.6)
  Top 0.406: U$1.PB10 10.49,66.99 10,67.48 10,86.08 v10.2,86.28 | v7.6,112.88 7.4,112.88 6.7,113.58 6.7,139.38 13.1,145.78 25,145.78 26.6,147.38 26.6,148.78 31.3,153.48 49.6,153.48 50.9,152.18 50.9,149.1 SW1.10
  Bottom 0.406: v10.2,86.28 9.2,86.28 7.6,87.88 v7.6,112.88
PB10_D
  Bottom 0.406: CAM.3 45.7,164.34 45.7,161.28 47.9,159.08 49.2,159.08 51.63,156.65 SW1.11
PB11  (via drill 0.6)
  Top 0.406: U$1.PB11 15.69,67.09 14.5,68.28 11.2,68.28 10.9,68.58 10.9,84.28 v11.1,84.48 | v7.8,114.98 7.8,139.08 13.6,144.88 28.2,144.88 30,146.68 30,150.48 32.2,152.68 47.8,152.68 49.1,151.38 SW1.9
  Bottom 0.406: v11.1,84.48 11.1,85.68 11.5,86.08 11.5,86.68 8.4,89.78 8.4,111.98 9,112.58 9,113.78 v7.8,114.98
PB11_D
  Bottom 0.406: CAM.4 44.6,162.9 44.6,160.88 47.4,158.08 48.2,158.08 49.09,157.19 SW1.12
PB12  (via drill 0.6)
  Top 0.406: v51.6,38.98 51.6,51.18 v53.1,52.68
  Bottom 0.406: SW3.2 40.19,38.07 41.1,39.18 51.4,39.18 v51.6,38.98 | v53.1,52.68 53.1,60.16 U$1.PB12
PB12_D
  Bottom 0.406: SW3.11 40.9,25.68 40.9,28.48 42.3,29.88 56.7,29.88 65.7,20.88 65.7,5.58 63.8,2.98 35,2.98 30,6.18 23.3,6.18 21.51,7.97 LCD.T_IRQ
PB13  (via drill 0.6)
  Top 0.406: v62.2,36.68 62.2,47.78 v62.6,48.28
  Bottom 0.406: SW3.6 50.35,34.63 51.9,36.28 62,36.28 v62.2,36.68 | v62.6,48.28 62.6,66.28 62.2,66.78 60.14,66.78 U$1.PB13
PB13_D
  Bottom 0.406: SW3.7 52.74,22.58 58.3,22.58 61.7,19.08 61.7,7.28 60.7,6.18 36.1,6.18 34.21,7.37 LCD.T_CLK
PB14  (via drill 0.6)
  Top 0.406: 57.6,67.18 57.41,66.99 U$1.PB14 56.88,66.48 v49.7,66.48 | v47.9,38.18 47.9,51.18 v49.2,52.78
  Bottom 0.406: SW3.3 42.73,37.21 43.4,38.08 47.2,38.08 v47.9,38.18 | v49.2,52.78 49.2,65.98 v49.7,66.48
PB14_D
  Bottom 0.406: SW3.10 42.9,25.14 42.9,27.38 44.6,29.08 56.4,29.08 64.7,20.78 64.7,5.88 63.1,3.78 35.3,3.78 30.5,6.98 24.8,6.98 24.05,7.73 LCD.T_DO
PB15  (via drill 0.6)
  Top 0.406: v63.6,38.18 v63.6,52.18
  Bottom 0.406: SW3.4 45.27,36.75 45.6,37.18 60.7,37.18 61.7,38.18 v63.6,38.18 | v63.6,52.18 63.6,68.18 62.3,69.38 60.08,69.38 U$1.PB15
PB15_D
  Bottom 0.406: SW3.9 46.2,25.9 46.2,27.88 46.6,28.28 56,28.28 63.8,20.48 63.8,6.48 62.3,4.58 35.6,4.58 30.9,7.68 29.17,9.41 29.17,9.51 LCD.T_DIN
PC0  (via drill 0.6)
  Top 0.406: v52.6,112.58 50.19,110.17 U$1.PC0
  Bottom 0.406: CON1.27 77.43,114.88 73.9,114.88 70.5,111.48 54.8,111.48 53.7,112.58 v52.6,112.58
PC2  (via drill 0.6)
  Top 0.406: v54.1,109.98 51.75,107.63 U$1.PC2
  Bottom 0.406: CON1.30 74.8,111.08 73.9,110.18 67.1,110.18 66.17,109.25 66.17,108.98 55,108.98 54.1,109.88 v54.1,109.98
PC6  (via drill 0.6, 1)
  Top 0.406: U$1.PC6 59.87,89.85 58.6,88.58 56.7,88.58 54.6,86.48 54.6,85.28 51.3,81.98 51.4,81.98 v51.5,81.88 | v45.6,137.87 45.6,141.58 44.3,142.88 40.6,142.88 38.9,144.58 38.93,144.54 SW1.5
  Route8 0.406: v46.4,72.91 46.4,73.38 47.7,74.68 47.7,132.58 46.9,133.38 46.9,136.57 v45.6,137.87
  Bottom 0.406: v51.5,81.88 51.5,80.58 47.7,76.58 47.7,74.21 v46.4,72.91
PC6_D
  Bottom 0.406: CAM.13 31.69,165.49 33,164.18 33,160.78 34.6,159.18 36.84,159.18 38.93,157.09 SW1.16
PC7  (via drill 0.6, 1)
  Top 0.406: U$1.PC7 56.17,89.85 49.4,82.88 v49.4,81.38 | v45.61,135.33 44.36,136.58 44.36,139.22 41.7,141.88 39.9,141.88 36.39,145.39 SW1.4
  Route8 0.406: v46.42,75.43 46.4,75.45 46.4,132.58 45.61,133.37 v45.61,135.33
  Bottom 0.406: v49.4,81.38 49.3,80.38 46.42,77.2 v46.42,75.43
PC7_D
  Bottom 0.406: CAM.14 31.69,160.69 34.3,158.08 35.6,158.08 36.39,157.29 SW1.17
PC8  (via drill 0.6)
  Top 0.406: v63.5,89.78 63.6,89.78 61.7,86.08 55.6,86.08 55.6,83.78 51.9,79.88 45.4,79.88 44.3,78.98 v24.2,78.98
  Bottom 0.406: U$1.PC8 63.09,92.39 63.8,91.68 63.8,90.08 v63.5,89.78 | v24.2,78.98 24.2,72.28 26,70.48 30.4,70.48 32.4,68.48 32.4,63.88 18,49.58 18,47.94 SW4.6
PC8_D
  Bottom 0.406: LCD.SD_DO/D0 20.2,10.74 20.2,15.58 25.3,20.68 29.06,20.68 SW4.7
PC9  (via drill 0.6)
  Top 0.406: v23.2,39.48 11.8,50.68 v11.6,50.88
  Bottom 0.406: SW4.2 23.19,38.99 23.2,39.68 v23.2,39.48 | U$1.PC9 56.81,92.39 45.4,80.98 11.2,80.98 10.9,80.68 10.9,51.58 v11.6,50.88
PC9_D
  Bottom 0.406: SW4.11 23.19,25.89 20.9,28.18 11.9,28.18 10,30.08 4.1,30.08 3.7,29.48 3.7,10.68 4.6,9.58 6.2,9.58 LCD.SD_D1
PC10
  Top 0.406: SW4.1 20.65,35.63 18.3,37.98 12.2,37.98 6.8,43.18 6.8,109.08 11.8,113.98 53.2,113.98 55.8,111.38 62.7,111.38 64.1,109.98 64.1,106.38 63.3,105.58 60.42,105.58 U$1.PC10 59.93,105.01
PC10_D
  Bottom 0.406: LCD.SD_D2 6.3,18.58 6.3,19.78 8.1,21.58 19.1,21.58 20.65,23.13 SW4.12
PC11
  Top 0.406: SW4.3 19.34,38.98 12.7,38.98 7.6,43.88 7.6,93.08 8.4,93.68 25.4,93.68 36.81,105.09 U$1.PC11
PC11_D  (via drill 0.6)  (1 unrouted)
  Top 0.406: v11.1,6.98 11.1,7.18 10.1,8.48 10.1,17.38 15.2,22.48 24.7,22.48 25.73,23.51 SW4.10
  Bottom 0.406: 11.53,9.51 11.53,7.41 v11.1,6.98
PC12
  Top 0.406: SW4.5 30.81,33.87 9.2,55.28 9.2,87.28 11.4,88.58 41,88.58 56.2,103.78 58.3,103.78 58.5,103.98 58.5,104.08 58.7,104.28 58.7,106.4 U$1.PC12
PC12_D
  Bottom 0.406: LCD.SD_CLK 17.7,10.78 17.6,13.18 17.6,19.28 18.5,20.18 22.2,20.18 23.8,22.28 27.6,22.28 30.79,24.97 SW4.8
PC13
  Bottom 0.406: LCD.REST 13.87,12.05 12.3,13.68 10.1,13.68 10.1,8.48 9,7.48 4.9,7.48 2.9,9.68 2.9,31.48 5,36.28 5,127.98 7.51,130.49 U$1.PC13
PD0  (via drill 0.6)
  Top 0.406: v85.4,72.08 85.7,71.78 85.7,65.88 87.3,64.28 87.3,25.88 67.5,6.18 50,6.18 49.4,6.78 v49.4,7.28 | v62.4,107.68 61.1,108.98 58.74,108.98 U$1.PD0 | v72.7,148.58 73.3,147.98 76,147.98 77,149.08 82.1,149.08 85.5,146.08 v87.3,144.48 | v85.5,122.58 84.97,121.61 v85,119.71
  Bottom 0.406: v85.4,72.08 77.84,72.08 CON1.57 77.45,71.73 77.8,72.08 85.6,72.08 87.5,73.98 87.33,111.58 | 87.33,111.58 87.3,117.18 v85,119.71 | v62.4,107.68 62.5,107.58 66.3,107.58 67.8,109.28 74,109.28 74.7,109.78 79.68,109.78 79.74,109.85 81,111.18 86.92,111.18 87.33,111.58 | v72.7,148.58 75.5,149.21 CON1.4 | LCD.DB2 49.45,7.33 v49.4,7.28 | v87.3,144.48 87.3,140.28 85.3,138.48 85.3,134.88 85.5,134.68 v85.5,122.58
PD1  (via drill 0.6)
  Top 0.406: v86.8,69.48 86.8,65.88 88.1,64.58 88.1,25.48 67.8,5.18 47.3,5.18 46.91,5.67 46.9,5.68 v46.9,7.28 | v65.2,112.68 65.4,112.48 v65.4,110.18
  Bottom 0.406: v86.8,69.48 86.7,69.38 85.2,70.38 75.58,70.38 CON1.58 85.13,70.41 88.4,73.68 88.4,118.08 84.2,121.88 84.2,124.18 84.5,124.68 | 84.5,124.68 79.8,124.68 77,121.88 71.8,121.88 64.3,129.28 55.5,129.28 54.8,128.58 54.8,125.08 55.7,124.18 62.5,124.18 65.2,121.48 v65.2,112.68 | v65.4,110.18 v65.39,110.17 U$1.PD1 | LCD.DB3 v46.91,7.29 v46.9,7.28 | CON1.5 82.09,147.88 86.4,143.58 86.4,141.08 84.5,139.28 84.5,124.68
PD2  (via drill 0.6)
  Top 0.406: SW4.4 18.58,42.28 11.5,42.28 8.4,45.08 8.4,90.08 9.9,91.08 v22.6,91.08 | U$1.PD2 53.5,106.28 35.4,106.28 34,104.88 v32.8,104.88
  Bottom 0.406: v22.6,91.08 22.6,94.68 v32.8,104.88
PD2_D
  Bottom 0.406: LCD.SD_DIN/CMD 15.1,10.72 15.1,19.48 16.5,20.88 21.4,20.88 23.2,23.08 27.1,23.08 28.27,23.85 SW4.9
PD3  (via drill 0.6)
  Top 0.406: v24.3,143.48 24.3,123.88 26.8,121.38 53.7,121.38 54.2,121.58 63.1,121.58 v63.7,121.28
  Bottom 0.406: SW5.3 24.44,143.62 v24.3,143.48 | v63.7,121.28 63.7,114.28 62.6,113.08 60.3,113.08 U$1.PD3
PD3_D
  Bottom 0.406: CAM.18 26.61,160.69 24.4,158.48 24.4,156.03 SW5.4
PD4  (via drill 0.6)
  Top 0.406: v49.5,115.18 v30.3,115.18 | v6.9,36.18 6.9,33.08 8.5,31.48 8.5,19.78 4.7,15.98 4.7,8.68 6.1,5.78 37.2,5.78 v40.5,7.38
  Bottom 0.406: U$1.PD4 55.07,112.71 53.4,114.38 50.3,114.38 v49.5,115.18 | v30.3,115.18 21.8,115.18 17.4,119.08 9.6,119.08 6.7,116.68 6.7,36.38 v6.9,36.18 | v40.5,7.38 40.5,10.72 LCD.RD
PD5  (via drill 0.6)  (1 unrouted)
  Top 0.406: v62.4,120.28 66.9,120.28 67.7,119.48 75,119.48 80.9,125.88 89.5,125.88 90.5,124.18 90.5,82.18 82.5,74.18 82.5,63.68 83.2,62.98 83.2,55.18 84.7,53.68 84.7,27.28 67.8,10.38 57.7,10.38 v57.3,10.78
  Bottom 0.406: U$1.PD5 61.97,115.25 62.4,115.68 v62.4,120.28 | LCD.WR 44.43,12.05 45.7,10.78 | 45.64,10.78 v57.3,10.78
PD6  (via drill 0.6)
  Top 0.406: v21.6,129.18 10.6,129.18 9,127.58 9,112.58 6,109.58 6,46.68 4.7,45.38 4.7,34.88 4,31.68 4,8.48 v4.5,6.38
  Bottom 0.406: U$1.PD6 54.83,115.25 53.6,116.48 46.4,116.48 33.7,129.18 v21.6,129.18 | v4.5,6.38 4.5,6.48 5.5,5.68 21.9,5.68 23,5.38 29.6,5.38 34.8,2.08 64.7,2.08 66.7,4.98 66.7,20.98 57.1,30.58 48.2,30.58 47.9,30.88 47.9,32.5 SW3.5
PD6_D
  Bottom 0.406: SW3.8 48.2,25.36 48.2,27.18 48.5,27.48 55.5,27.48 62.8,20.08 62.8,6.58 61.8,5.38 35.8,5.38 31.67,8.11 LCD.T_CS
PD7  (via drill 0.6)
  Top 0.406: v19.1,14.48 19.1,19.18 20.3,20.38 24.9,20.38 25.2,20.68 27,22.78 27,26.88 25.1,28.78 20.6,28.78 17.7,31.68 17.7,37.18 10.4,37.18 5.9,41.68 v5.9,44.28
  Bottom 0.406: v5.9,44.28 5.9,127.48 7.6,129.18 17.6,129.18 18.8,130.38 34,130.38 46.7,117.88 54.2,117.78 55.4,116.58 58.9,116.58 59.93,117.61 U$1.PD7 | LCD.CS 18.97,14.35 v19.1,14.48
PD8  (via drill 0.6, 1)
  Top 0.406: v65.6,62.68 59,62.68 58.7,62.88 58.7,68.28 57.45,69.53 U$1.PD8 57.25,69.53 55.8,68.08 47.1,68.08 46.1,69.08 39.7,69.08 38.7,70.08 38.7,72.78 v38.8,72.88 | v44.5,127.88 39.2,133.18 39.2,136.48 37.97,137.71 v37.97,137.86
  Route8 0.406: v38.8,72.88 38.8,73.38 40.1,74.68 40.1,132.48 39.2,133.38 39.2,136.63 38.32,137.5 v37.97,137.86
  Bottom 0.406: v65.6,62.68 65.7,62.78 65.7,49.58 66.4,48.88 77.39,48.88 CON1.75 77.59,48.68 82,48.68 83.5,47.18 83.4,42.68 79.9,39.98 39.7,39.98 36.5,36.08 36.5,21.48 32.3,17.28 28.6,17.28 26.59,15.27 LCD.DB13 | CON1.17 71.31,127.56 62,136.88 56.5,136.88 47.5,127.88 v44.5,127.88
PD9  (via drill 1)
  Top 0.406: U$1.PD9 58.64,70.78 56.8,70.78 54.7,68.68 47.5,68.68 46.4,69.78 39.9,69.78 39.3,70.38 39.3,71.28 40.05,72.03 40.05,74.18 v38.78,75.45
  Route8 0.406: 38,134.78 38,134.88 37.98,134.9 v37.98,135.31 37.98,134.8 38,134.78 | 38,134.78 38,133.08 38.8,132.28 38.78,132.26 v38.78,75.45
  Bottom 0.406: U$1.PD9 61.41,72.07 64.7,68.68 64.7,48.88 66.03,47.55 CON1.76 75.62,47.48 81.7,47.48 82.5,46.68 82.5,43.18 79.5,40.78 39.1,40.78 35.6,36.58 35.6,22.28 31.7,18.38 27.4,18.38 24.05,15.03 LCD.DB14 | CON1.19 77.45,123.83 76.2,122.58 72.3,122.58 63.1,131.78 55.4,131.78 49.1,125.48 42.88,125.48 38.78,129.58 38.78,132.3 38,133.08 38,135.29 v37.98,135.31
PD10  (via drill 1)
  Top 0.406: U$1.PD10 57.09,72.07 54.8,69.78 47.3,69.78 46.6,70.48 42,70.48 41.3,71.18 41.3,72.87 v41.33,72.9
  Route8 0.406: v41.33,72.9 41.33,73.11 42.6,74.38 42.6,132.88 41.8,133.68 41.8,136.57 v40.52,137.85
  Bottom 0.406: U$1.PD10 58.66,71.37 58.65,70.88 58.65,66.58 58.8,65.78 60.9,65.78 61.5,64.88 61.5,47.28 62.9,46.28 CON1.77 81,46.28 81.4,45.88 81.4,43.48 78.9,41.58 38.3,41.58 34.6,36.88 34.6,23.18 31.1,19.68 26.6,19.68 21.6,14.68 21.64,13.98 LCD.DB15 | CON1.20 72.43,123.75 61.9,134.28 56.2,134.28 48.5,126.58 43.4,126.58 42.6,128.18 42.6,132.88 41.8,133.68 41.8,136.57 v40.52,137.85
PD11  (via drill 0.6)
  Top 0.406: v47.3,19.18 49.1,19.18 65.5,35.58 65.5,48.48 71.5,54.48 71.5,62.18 70.3,63.28 v69.7,63.28
  Bottom 0.406: LCD.RS 46.91,18.79 v47.3,19.18 | v69.7,63.28 66,66.98 66,69.18 62.2,72.98 62.2,74.28 61.87,74.61 U$1.PD11
PD12  (via drill 0.6)
  Top 0.406: v22.29,77.71 54.5,77.78 57.39,74.89 U$1.PD12
  Bottom 0.406: R1.2 13.1,47.08 28.1,62.08 29.4,62.08 31.5,64.18 31.5,68.08 30.29,69.29 23.99,69.29 22.3,70.98 v22.29,77.71
PD14  (via drill 0.6, 1)
  Top 0.406: v84.1,64.88 85.5,63.48 85.5,26.68 67.8,8.98 v58.8,8.98 | v72.4,64.78 72.4,67.38 63.9,75.88 58.66,75.88 U$1.PD14 56.73,77.15 55.3,78.68 v45.9,78.68
  Route8 0.406: v43.87,75.44 43.87,75.95 | 43.87,75.95 43.9,75.98 | 43.87,75.95 43.7,76.12 43.7,132.88 42.45,134.13 42.45,135.5 42.46,135.61 42.46,136.02 43.07,136.63 v43.07,137.83
  Bottom 0.406: CON1.55 77.39,74.28 72.2,74.28 68,78.48 58.6,78.48 57.39,77.27 U$1.PD14 | CON1.2 73.5,149.88 70.6,149.88 67.3,146.58 58.8,146.58 52.7,140.48 44.4,140.48 43.07,139.15 v43.07,137.83 | v84.1,64.88 72.5,64.88 v72.4,64.78 | 43.8,75.08 43.87,75.15 v43.87,75.44 43.9,75.47 43.9,76.58 v45.9,78.68 | LCD.DB0 58.8,9.51 v58.8,8.98
PD15  (via drill 0.6)
  Top 0.406: v52,7.38 52.4,6.98 67.1,6.98 86.4,26.28 86.4,63.88 84.9,65.38 84.9,70.98 84.3,71.58 84.3,73.08 v84.2,73.18 92.2,81.18 92.2,150.18 84.75,150.42 84.3,150.88 v84.3,153.68
  Bottom 0.406: CON1.56 75.62,72.88 79.5,72.88 81,74.38 | 81,74.38 81,76.68 77.99,79.69 U$1.PD15 | v84.2,73.18 82.1,73.18 81.5,73.78 81.5,73.88 81,74.38 | LCD.DB1 v51.99,7.39 v52,7.38 | CON1.3 81.04,150.42 v84.3,153.68
PE0  (via drill 0.6)
  Top 0.406: v86,85.98 89,88.98 89,120.18 88.8,120.38 v88.8,120.88 88.5,121.18 88.5,123.88 87.9,124.48 82.5,124.48 80.5,122.28 v80.3,121.68 | v88.5,137.88 87.6,138.78 60.6,138.78 U$1.PE0
  Bottom 0.406: CON1.46 85.68,85.66 v86,85.98 | v88.8,120.88 88.5,121.48 v88.5,137.88 | CON1.28 82.31,113.59 82.7,113.98 82.7,117.78 82.5,117.98 82.5,120.38 81.3,121.58 80.4,121.58 v80.3,121.68
PE1  (via drill 0.6)
  Top 0.406: v86,84.28 89.8,88.08 89.8,121.68 v89.4,122.08 89.4,124.28 88.5,125.18 81.4,125.18 80.3,123.88 v80.3,123.68 | v88.2,139.58 58.86,139.58 U$1.PE1
  Bottom 0.406: CON1.47 85.9,84.38 v86,84.28 | v89.4,122.08 89.4,138.38 v88.2,139.58 | CON1.29 79.84,112.32 80.2,112.68 84.1,112.68 84.5,113.08 84.5,117.38 83.3,118.58 83.3,120.68 v80.3,123.68
PE2
  Bottom 0.406: SW1.1 28.77,149.31 26.4,151.68 22.2,151.68 20.6,150.08 20.6,145.56 U$1.PE2
PE2_D
  Bottom 0.406: CAM.17 26.61,165.57 27.9,164.28 27.9,156.86 SW1.20
PE5
  Bottom 0.406: SW5.2 21.9,139.58 18.2,135.88 16,135.88 U$1.PE5
PE5_D
  Bottom 0.406: CAM.19 24.07,165.41 25.3,164.18 25.3,161.58 21.9,158.18 SW5.5
PE6
  Bottom 0.406: SW5.1 9.3,138.31 9.3,134.78 11.05,133.03 U$1.PE6
PE6_D
  Bottom 0.406: CAM.20 19.36,158.4 SW5.6
PE7  (via drill 0.6, 1)
  Top 0.406: v63.4,73.28 63.3,73.38 56,73.38 52.5,76.88 41.4,76.88 | 41.4,76.88 23.4,76.88 22.7,76.18 20.7,76.18 17.2,79.68 U$1.PE7 | v88,66.98 88.9,66.08 88.9,25.08 68.1,4.18 46.4,4.18 45.47,5.11 45.4,5.24 v45.4,7.28 | 41.4,76.88 41.32,76.8 v41.32,75.46 | v40.53,135.33 40.65,135.33 42.5,133.48 45.9,133.48 57.8,145.38 v61.5,145.38
  Route8 0.406: v40.53,135.33 40.53,133.45 41.2,132.78 41.2,75.58 v41.32,75.46
  Bottom 0.406: v63.4,73.28 68.81,67.88 CON1.60 76.44,66.98 v88,66.98 | LCD.DB4 44.37,7.31 v45.4,7.28 | v61.5,145.38 77.41,145.38 CON1.7
PE8  (via drill 0.6, 1)
  Top 0.406: v69.7,61.08 69.2,61.08 68.3,61.68 v47.2,61.68 28.9,61.68 27.37,63.11 27.37,68.31 17.3,78.38 14.38,78.38 U$1.PE8 | v46.6,49.58 46.6,23.28 43.1,19.78 v43.1,14.98
  Route8 0.406: v43.84,72.94 43.86,72.94 45.1,74.18 45.1,132.68 43.06,134.72 v43.06,135.32
  Bottom 0.406: CON1.65 70.75,61.52 v69.7,61.08 | v46.6,49.58 46.6,61.08 v47.2,61.68 46.7,62.18 41.9,62.18 39.9,64.18 39.9,66.48 43.7,70.28 43.7,72.38 43.84,72.52 v43.84,72.94 | LCD.DB5 41.83,9.61 43.1,10.88 v43.1,14.98 | CON1.8 57.49,144.07 53.1,139.68 44.92,139.68 44.37,139.13 44.37,136.71 44.4,136.68 44.4,136.66 v43.06,135.32
PE9  (via drill 0.6, 1)
  Top 0.406: v70.4,59.78 68.8,59.78 67.8,60.78 v45.1,60.78 27.8,60.78 26.65,61.81 26.65,67.91 17.5,77.08 15.76,77.08 U$1.PE9 | v44.5,49.88 44,49.38 44,23.28 40.6,19.88 v40.6,18.58 | v47.5,131.48 47.5,126.18 47.1,125.78 40.8,125.78 35.5,131.08 v35.5,135.28
  Route8 0.406: v36.3,75.48 36.3,131.98 35.4,132.88 35.4,135.18 v35.5,135.28
  Bottom 0.406: CON1.66 74.57,60.25 74,59.78 v70.4,59.78 | v44.5,49.88 44.5,60.18 v45.1,60.78 44.7,61.18 41.5,61.18 38.4,64.28 38.4,71.18 37.5,72.08 37.5,74.18 v36.3,75.48 36.25,75.48 36.25,75.13 36.2,75.08 | LCD.DB6 39.29,9.69 38,10.98 38,15.98 v40.6,18.58 | CON1.9 77.42,142.78 58.2,142.78 53.7,138.28 53.7,137.68 v47.5,131.48
PE10  (via drill 0.6, 1)
  Top 0.406: v41.5,59.82 63.9,59.88 64.8,59.88 65.4,59.68 v66.9,59.68 | v41.5,59.82 40.2,59.82 | 40.2,59.82 26.8,59.78 25.77,60.83 25.77,67.53 17.4,75.88 14.42,75.88 U$1.PE10 | v41,52.48 38.9,49.88 38.9,22.98 38,22.08 v38,18.28 | v41.5,59.82 40.2,59.82 | v46.3,129.18 46,128.88 46,127.28 45.4,126.68 41.5,126.68 36.7,131.48 36.7,136.58 v35.4,137.88
  Route8 0.406: v36.24,72.93 36.35,72.93 37.5,74.08 37.5,132.38 36.6,133.28 36.6,136.68 v35.4,137.88
  Bottom 0.406: CON1.67 74.91,58.98 73.7,57.78 70.8,57.78 68.9,59.68 v66.9,59.68 | v41,52.48 41,54.48 41.5,54.98 v41.5,59.82 36.94,64.38 36.94,71.24 36.2,72.18 | LCD.DB7 36.75,9.83 35.5,11.08 35.5,15.78 v38,18.28 | v36.24,72.93 36.2,72.18 | 36.2,72.18 36.2,72.88 | CON1.10 73.49,139.48 56.7,139.48 55.3,138.08 55.3,137.08 47.4,129.18 v46.3,129.18
PE11  (via drill 0.6)
  Top 0.406: U$1.PE11 15.76,74.68 17.3,74.68 25,66.98 25,59.58 25.7,58.88 v43.3,58.88 65.2,58.88 65.5,58.58 v68.4,58.58 | v42.7,50.18 41.5,47.98 41.5,22.78 39.29,20.19 39.3,20.18 v39.3,15.38 | v84.2,56.18 84.3,56.28 84.3,62.98 83.2,64.08 83.2,73.78 91.3,81.88 91.3,129.28 84.2,136.38 75.7,136.38 73.2,135.18 v72.2,135.18
  Bottom 0.406: v68.4,58.58 70.63,56.44 CON1.69 77.71,56.18 v84.2,56.18 | v42.7,50.18 42.7,56.38 43.3,57.48 v43.3,58.88 | LCD.DB8 v39.29,15.37 v39.3,15.38 | CON1.11 73.31,135.19 v72.2,135.18
PE12  (via drill 0.6, 1)
  Top 0.406: U$1.PE12 14.46,73.38 17.2,73.38 24.1,66.48 24.1,58.68 24.9,57.88 v40.4,57.88 66.6,57.78 v66.8,57.48 | v39,52.18 36.5,49.38 36.5,21.48 36.8,21.18 v36.8,15.38 | v70.4,132.08 69,132.08 67.2,130.38 64.7,130.38 63.6,129.28 56.3,129.28 51.2,124.18 34.69,124.18 33.69,125.18 33.69,130.19 33,130.88 33,135.18 v32.9,135.28
  Route8 0.406: v33.69,75.48 33.69,130.09 33,130.78 33,135.18 v32.9,135.28
  Bottom 0.406: CON1.70 70.5,55.17 68.2,57.48 v66.8,57.48 | v39,52.18 39,54.28 40.3,55.58 40.3,57.58 v40.4,57.88 35.9,62.38 35.9,70.88 35,71.78 35,74.28 34.9,74.28 33.69,74.99 33.69,75.19 | LCD.DB9 36.75,15.33 v36.8,15.38 | v33.69,75.48 33.69,75.19 | 33.69,75.19 33.7,75.18 | CON1.13 71.47,132.65 v70.4,132.08
PE13  (via drill 0.6, 1)
  Top 0.406: v67.3,55.98 66.3,55.98 65.5,56.78 38.8,56.78 | 38.8,56.78 24.6,56.78 23.1,58.28 23.1,66.28 17.5,71.88 15.88,71.88 U$1.PE13 | v33.5,15.28 33.5,20.18 35.6,22.28 35.6,50.98 v36.9,52.28 | v38.8,56.08 38.8,56.78 | v32.9,137.88 34.2,136.58 34.2,131.18 35,130.38 35,126.28 36.3,124.98 49.5,124.98 55.2,130.68 55.2,133.18 56.3,134.28 62.1,134.28 63.8,135.98 67.6,135.98 67.8,135.78 v67.8,135.58
  Route8 0.406: v33.7,72.88 33.7,72.98 35,74.28 35,131.68 34.1,132.58 34.1,136.68 v32.9,137.88
  Bottom 0.406: CON1.71 74.68,53.91 70.3,53.88 68.2,55.98 v67.3,55.98 | LCD.DB10 34.21,14.57 v33.5,15.28 | v36.9,52.28 36.9,54.18 v38.8,56.08 35,59.88 35,70.18 33.7,71.48 v33.7,72.88 | CON1.14 72.6,131.38 71.2,131.38 70.7,130.88 69.5,130.88 67.8,132.58 v67.8,135.58
PE14  (via drill 0.6, 1)
  Top 0.406: v67.7,54.38 65.3,54.38 64.5,54.98 35.2,54.88 | 35.2,54.88 24.5,54.88 22,57.48 22,65.88 17.1,70.78 14.4,70.78 U$1.PE14 | v31.7,15.38 31.7,20.28 34.6,23.18 34.6,52.18 v34.5,52.28 | v35.2,55.68 35.2,54.88 | v70.8,129.58 65.2,129.58 62.3,126.68 55.1,126.68 51.5,123.08 32.7,123.08 32,123.78 32,134.08 31.6,134.48 31.6,136.61 v30.35,137.86
  Route8 0.406: v31.18,72.9 31.18,74.26 32,75.08 32,134.08 31.6,134.48 31.6,136.61 v30.35,137.86
  Bottom 0.406: CON1.72 74.44,52.63 69.6,52.58 67.8,54.38 v67.7,54.38 | LCD.DB11 31.67,15.35 v31.7,15.38 | v34.5,52.28 34.5,55.18 v35.2,55.68 34.1,56.78 34.1,69.68 31.1,72.68 31.1,72.82 v31.18,72.9 | CON1.15 77.37,130.18 71.4,130.18 v70.8,129.58
PE15  (via drill 0.6, 1, 1 pad 1.27)
  Top 0.406: v67.7,52.48 65.7,52.48 64,53.98 32.1,53.98 | 31.4,53.98 24,53.98 21,57.08 21,65.58 17.05,69.53 U$1.PE15 | v29.4,15.88 29.4,20.38 32.1,23.08 32.1,53.98 | 32.1,53.98 31.4,53.98 | 31.4,53.98 v30.3,52.88 | v72,128.78 67.4,124.18 53.9,124.18 51.9,122.18 31.5,122.18 30.36,123.32 v30.36,135.33
  Route8 0.406: v31.18,75.45 30.36,76.27 v30.36,135.33
  Bottom 0.406: CON1.74 67.76,50.08 v67.7,52.48 | LCD.DB12 29.13,15.61 v29.4,15.88 | v30.3,52.88 30.3,58.58 33.3,61.58 33.3,69.08 30.8,71.58 29.7,71.58 28.7,72.58 28.7,74.68 29.47,75.45 v31.18,75.45 | CON1.16 75.49,128.78 v72,128.78
PF0
  Bottom 0.406: CON1.33 77.41,107.28 69.9,107.28 69,106.38 55.1,106.38 33.53,127.95 U$1.PF0
PF1  (via drill 0.6)
  Top 0.406: v84.3,107.68 84.4,107.78 84.4,116.18 83.3,117.28 73.3,117.28 70,113.98 55,113.98 52.4,116.58 11.5,116.58 9.9,118.18 9.9,124.08 11.23,125.41 U$1.PF1
  Bottom 0.406: CON1.117 81.69,107.68 v84.3,107.68
PF2
  Bottom 0.406: CON1.34 75.45,105.88 70.7,105.88 68.7,103.88 54.5,103.88 32.97,125.41 U$1.PF2
PF3  (via drill 0.6)
  Top 0.406: v84.9,105.98 85.5,106.58 85.5,117.28 84.8,117.98 71.7,117.98 70.3,116.58 54.8,116.58 52.3,119.08 12.2,119.08 11,120.28 11,121.58 12.29,122.87 U$1.PF3
  Bottom 0.406: CON1.118 v84.9,105.98
PF4
  Bottom 0.406: CON1.35 77.37,104.78 71.1,104.78 67.6,101.28 53.3,101.28 30,124.58 17.8,124.58 16.89,122.87 U$1.PF4
PF5  (via drill 0.6)
  Top 0.406: v85,104.58 86.5,106.08 86.5,118.08 86,118.68 65.5,118.78 65.4,119.08 55.1,119.08 53.6,120.58 19.6,120.58 18.6,121.58 14.1,121.58 13.15,120.63 U$1.PF5
  Bottom 0.406: CON1.119 81.38,104.58 v85,104.58
PF11  (via drill 0.6)
  Top 0.406: v85.3,94.48 84.3,95.88 74.1,95.88 73.8,96.18 55.7,96.18 45.6,86.08 14.1,86.08 13.15,87.03 U$1.PF11
  Bottom 0.406: CON1.115 86.1,108.84 86.1,95.68 85.2,94.58 v85.3,94.48
PF12
  Bottom 0.406: CON1.36 75.39,103.28 71.2,103.28 66.7,98.78 55.6,98.78 44.13,87.31 U$1.PF12
PF13  (via drill 0.6)
  Top 0.406: v83.2,93.68 81.7,95.08 74.7,95.08 73.4,93.78 55.8,93.68 45.6,83.48 14,83.48 13.15,84.33 U$1.PF13
  Bottom 0.406: CON1.120 79.4,103.48 84.5,103.38 85.2,102.38 85.2,96.08 83.2,93.48 v83.2,93.68
PF14
  Bottom 0.406: CON1.37 77.43,102.18 71.4,102.18 65.4,96.18 55.8,96.18 44.39,84.77 U$1.PF14
PF15  (via drill 0.6)
  Top 0.406: v81.2,94.08 75.2,94.08 73.5,92.58 62.8,92.58 61.3,91.08 55.4,91.08 45.3,80.98 14.3,80.98 13.15,82.13 U$1.PF15
  Bottom 0.406: CON1.121 84.1,100.82 84.1,96.98 81.4,93.98 v81.2,94.08
PG0
  Bottom 0.406: CON1.38 74.31,100.89 71.5,100.88 64.23,93.68 56,93.68 44.55,82.23 U$1.PG0
PG1
  Bottom 0.406: CON1.123 81.26,97.54 78.5,94.78 74.8,94.78 70.2,90.48 68.3,88.58 54.5,88.58 45.9,79.98 18.8,79.98 17.2,78.38 14.5,78.38 13.21,79.69 U$1.PG1
PG4  (via drill 0.6)
  Top 0.406: v68.9,87.38 65.7,87.38 65.6,87.28 63.6,83.48 58.8,83.48 57.55,82.23 U$1.PG4
  Bottom 0.406: CON1.122 79.37,100.88 81.8,100.88 82.8,99.88 82.8,97.78 78.8,93.78 75.5,93.78 70.7,89.18 v68.9,87.38
PG5  (via drill 0.6)
  Top 0.406: v69.4,97.28 74.7,97.28 74.8,96.98 85.7,96.98 86.4,96.28 86.4,93.38 85.7,92.48 79.5,92.48 78.8,93.18 76.1,93.18 74.6,91.68 66.1,91.68 62.19,84.77 U$1.PG5
  Bottom 0.406: CON1.39 71.94,99.62 v69.4,97.28
PG8
  Bottom 0.406: CON1.79 74.98,43.78 59.4,43.78 51.8,51.08 51.8,75.98 53.7,77.88 53.7,86.18 54.83,87.31 U$1.PG8 58.46,86.08 69.5,86.08 73.96,90.73 CON1.42
PG10
  Bottom 0.406: U$1.PG10 59.93,120.45 58.8,121.58 45.6,121.58 35.1,132.08 26.6,132.08 21.8,136.88 21.8,137.38 29.8,145.38 32.3,145.38 33.9,146.98 33.9,148.32 SW1.3
PG10_D
  Bottom 0.406: CAM.15 29.15,165.43 30.4,164.18 30.4,159.44 31.76,158.08 32.5,158.08 33.85,156.73 SW1.18
PG11
  Bottom 0.406: U$1.PG11 57.24,120.48 45.5,120.48 34.7,131.28 26.2,131.28 21.1,136.38 21.1,137.68 31.31,147.89 SW1.2
PG11_D
  Bottom 0.406: CAM.16 29.3,162.96 29.3,158.38 31.31,156.37 SW1.19
PG15
  Bottom 0.406: CON1.111 81.3,114.91 81.3,117.88 80.5,118.68 72.8,118.68 65,126.68 58.3,126.68 57.39,125.29 U$1.PG15